# EAGLE design FW_Toolboard1_v71(Eagle 9) (EAGLE 9.7.0)
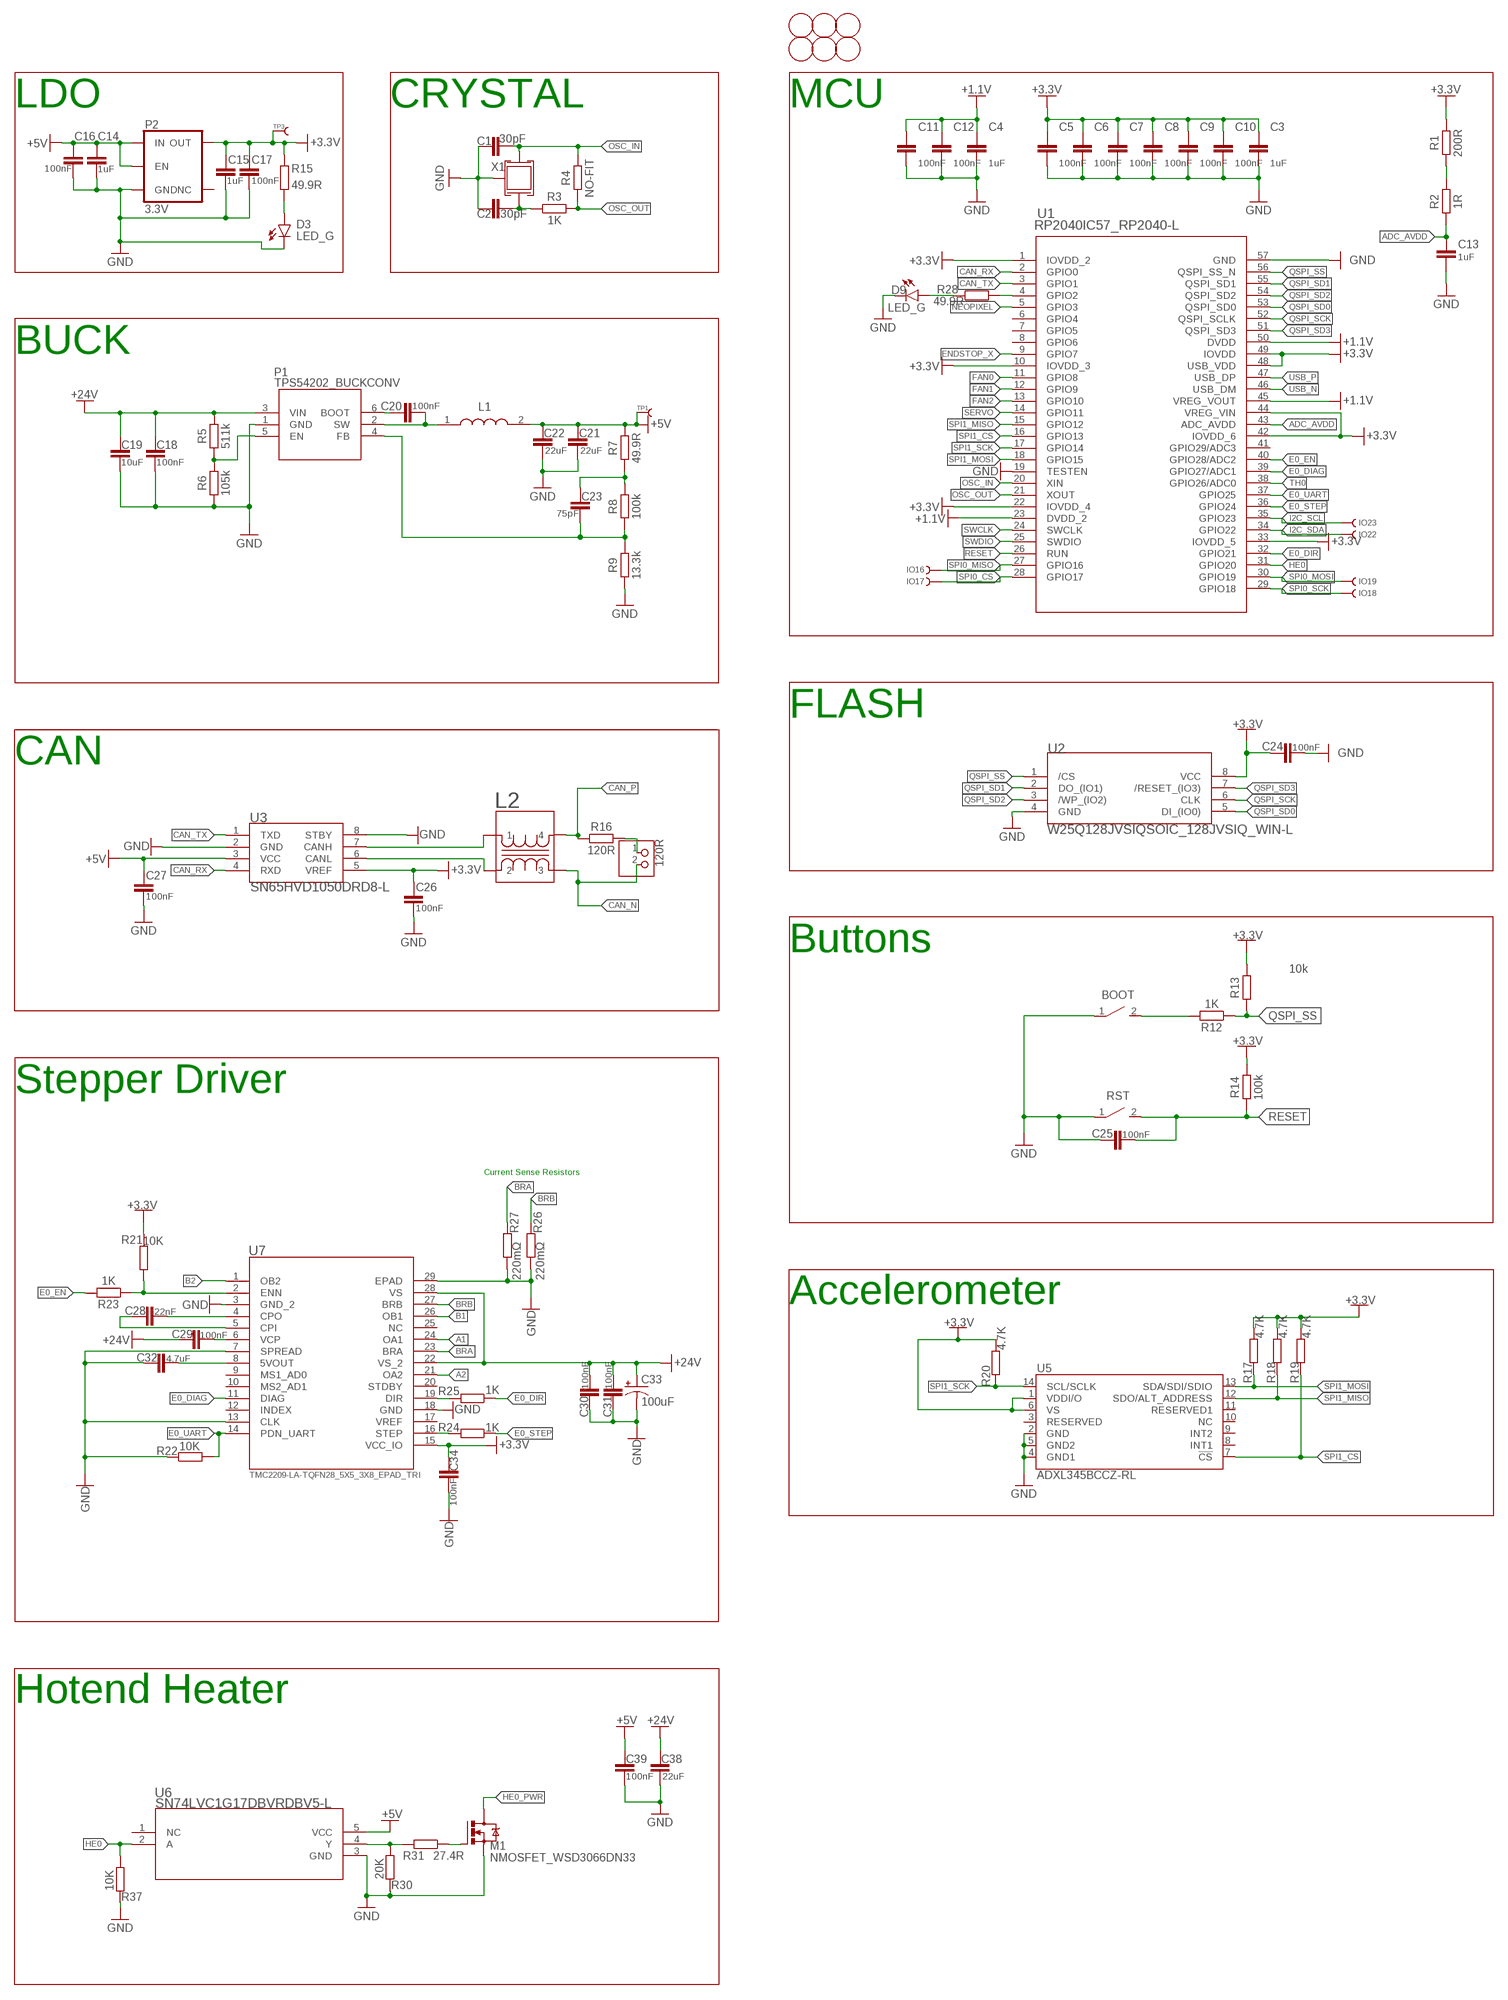
[diagram p0: schematic, sheet 1, part 1 of 2]
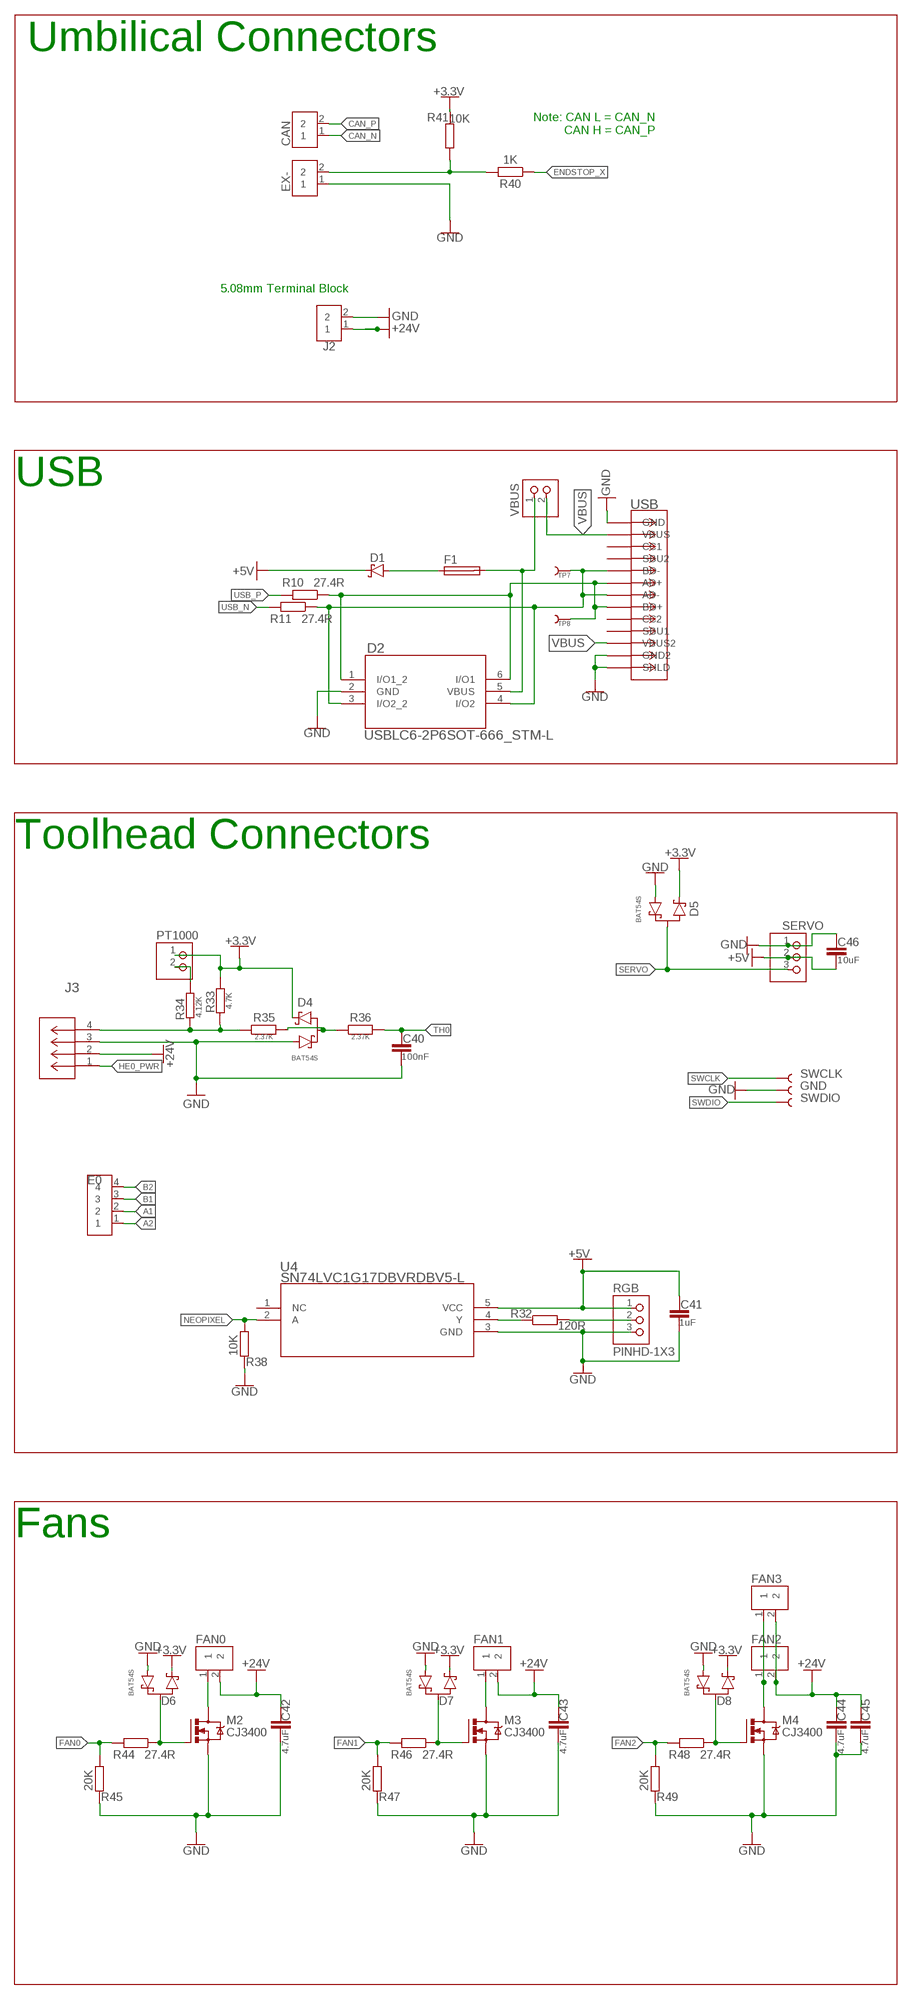
[diagram p1: schematic, sheet 1, part 2 of 2]

## Parts
120R  PINHD-1X2  [1X02]
BOOT  B3U-1000P(M)-B  B3U-X000B3U-1000P(M)-B1000P(M)-B  [B3U-1000P(M)-B]
C1  30pF  C_CHIP-0402(1005-METRIC)  [CAPC1005X60]
C2  30pF  C_CHIP-0402(1005-METRIC)  [CAPC1005X60]
C3  1uF  C_CHIP-0402(1005-METRIC)  [CAPC1005X60]
C4  1uF  C_CHIP-0402(1005-METRIC)  [CAPC1005X60]
C5  100nF  C_CHIP-0402(1005-METRIC)  [CAPC1005X60]
C6  100nF  C_CHIP-0402(1005-METRIC)  [CAPC1005X60]
C7  100nF  C_CHIP-0402(1005-METRIC)  [CAPC1005X60]
C8  100nF  C_CHIP-0402(1005-METRIC)  [CAPC1005X60]
C9  100nF  C_CHIP-0402(1005-METRIC)  [CAPC1005X60]
C10  100nF  C_CHIP-0402(1005-METRIC)  [CAPC1005X60]
C11  100nF  C_CHIP-0402(1005-METRIC)  [CAPC1005X60]
C12  100nF  C_CHIP-0402(1005-METRIC)  [CAPC1005X60]
C13  1uF  C_CHIP-0402(1005-METRIC)  [CAPC1005X60]
C14  1uF  C_CHIP-0402(1005-METRIC)  [CAPC1005X60]
C15  1uF  C_CHIP-0402(1005-METRIC)  [CAPC1005X60]
C16  100nF  C_CHIP-0402(1005-METRIC)  [CAPC1005X60]
C17  100nF  C_CHIP-0402(1005-METRIC)  [CAPC1005X60]
C18  100nF  C_CHIP-0402(1005-METRIC)  [CAPC1005X60]
C19  10uF  C_CHIP-0603(1608-METRIC)  [CAPC1608X85]
C20  100nF  C_CHIP-0402(1005-METRIC)  [CAPC1005X60]
C21  22uF  C_CHIP-0805(2012-METRIC)  [CAPC2012X110]
C22  22uF  C_CHIP-0805(2012-METRIC)  [CAPC2012X110]
C23  75pF  C_CHIP-0402(1005-METRIC)  [CAPC1005X60]
C24  100nF  C_CHIP-0402(1005-METRIC)  [CAPC1005X60]
C25  100nF  C_CHIP-0402(1005-METRIC)  [CAPC1005X60]
C26  100nF  C_CHIP-0402(1005-METRIC)  [CAPC1005X60]
C27  100nF  C_CHIP-0402(1005-METRIC)  [CAPC1005X60]
C28  22nF  C_CHIP-0402(1005-METRIC)  [CAPC1005X60]
C29  100nF  C_CHIP-0402(1005-METRIC)  [CAPC1005X60]
C30  100nF  C_CHIP-0402(1005-METRIC)  [CAPC1005X60]
C31  100nF  C_CHIP-0402(1005-METRIC)  [CAPC1005X60]
C32  4.7uF  C_CHIP-0603(1608-METRIC)  [CAPC1608X85]
C33  100uF  100UF-POLAR-25V-20%(ELEC)  [PANASONIC_D]
C34  100nF  C_CHIP-0402(1005-METRIC)  [CAPC1005X60]
C38  22uF  C_CHIP-0805(2012-METRIC)  [CAPC2012X110]
C39  100nF  C_CHIP-0402(1005-METRIC)  [CAPC1005X60]
C40  100nF  C_CHIP-0402(1005-METRIC)  [CAPC1005X60]
C41  1uF  C_CHIP-0402(1005-METRIC)  [CAPC1005X60]
C42  4.7uF  C_CHIP-0603(1608-METRIC)  [CAPC1608X85]
C43  4.7uF  C_CHIP-0603(1608-METRIC)  [CAPC1608X85]
C44  4.7uF  C_CHIP-0603(1608-METRIC)  [CAPC1608X85]
C45  4.7uF  C_CHIP-0603(1608-METRIC)  [CAPC1608X85]
C46  10uF  C_CHIP-0603(1608-METRIC)  [CAPC1608X85]
CAN  3A/250V  S2B-XH-A  [S2B-XH-A]
D1  MBR0520LT1G  SCHOTTKY_MBR0520LT1GDO-219  [SODFL3718X115]
D2  USBLC6-2P6SOT-666_STM-L  [SOT-666_STM-L]
D3  LED_G  CHIP-FLAT-G_0603-0.35MM  [LEDC1608X35N_FLAT-G]
D4  BAT54S  [SOT23]
D5  BAT54S  [SOT23]
D6  BAT54S  [SOT23]
D7  BAT54S  [SOT23]
D8  BAT54S  [SOT23]
D9  LED_G  CHIP-FLAT-G_0603-0.35MM  [LEDC1608X35N_FLAT-G]
E0  3A/250V  S4B-XH-A  [S4B-XH-A]
EX-  3A/250V  S2B-XH-A  [S2B-XH-A]
F1  FUSE_CHIP-0603(1608-METRIC)  [FUSC1608X60N]
FAN0  3A/250V  S2B-XH-A  [S2B-XH-A]
FAN1  3A/250V  S2B-XH-A  [S2B-XH-A]
FAN2  3A/250V  S2B-XH-A  [S2B-XH-A]
FAN3  3A/250V  S2B-XH-A  [S2B-XH-A]
FD1  FIDUCIAL  [FIDUCIAL_1MM]
FD2  FIDUCIAL  [FIDUCIAL_1MM]
FD3  FIDUCIAL  [FIDUCIAL_1MM]
FD4  FIDUCIAL  [FIDUCIAL_1MM]
FD5  FIDUCIAL  [FIDUCIAL_1MM]
FD6  FIDUCIAL  [FIDUCIAL_1MM]
GND  TEST-POINT3X4  [PAD.03X.04]
IO16  TEST-POINT3  [PAD.03X.03]
IO17  TEST-POINT3  [PAD.03X.03]
IO18  TEST-POINT3  [PAD.03X.03]
IO19  TEST-POINT3  [PAD.03X.03]
IO22  TEST-POINT3  [PAD.03X.03]
IO23  TEST-POINT3  [PAD.03X.03]
J2  2828XX-2282837-2  [TERMBLK_508-2N]
J3  430450400CON_430450400_MOL  [CON_430450400_MOL]
L1  ASPI-0630HI-100M-T157X7X4  [SMDRI74-680MT]
L2  ACM2012-201-2P-T002ACM2012_TDK  [ACM2012_TDK]
M1  NMOSFET_WSD3066DN33  [NMOSFET_WSD3066DN33]
M2  CJ3400  NMOSFET_BSS123_SOT23-GSD  [SOT23]
M3  CJ3400  NMOSFET_BSS123_SOT23-GSD  [SOT23]
M4  CJ3400  NMOSFET_BSS123_SOT23-GSD  [SOT23]
P1  TPS54202_BUCKCONV  [SOT-23-6]
P2  3.3V  V_REG_AP2112K-3.3V  [SOT23-5]
PT1000  PINHD-1X2  [1X02]
R1  200R  R_CHIP-0402(1005-METRIC)  [RESC1005X40]
R2  1R  R_CHIP-0402(1005-METRIC)  [RESC1005X40]
R3  1K  R_CHIP-0402(1005-METRIC)  [RESC1005X40]
R4  NO-FIT  R_CHIP-0402(1005-METRIC)  [RESC1005X40]
R5  511k  R_CHIP-0402(1005-METRIC)  [RESC1005X40]
R6  105k  R_CHIP-0402(1005-METRIC)  [RESC1005X40]
R7  49.9R  R_CHIP-0402(1005-METRIC)  [RESC1005X40]
R8  100k  R_CHIP-0402(1005-METRIC)  [RESC1005X40]
R9  13.3k  R_CHIP-0402(1005-METRIC)  [RESC1005X40]
R10  27.4R  R_CHIP-0402(1005-METRIC)  [RESC1005X40]
R11  27.4R  R_CHIP-0402(1005-METRIC)  [RESC1005X40]
R12  1K  R_CHIP-0402(1005-METRIC)  [RESC1005X40]
R13  10k  R_CHIP-0402(1005-METRIC)  [RESC1005X40]
R14  100k  R_CHIP-0402(1005-METRIC)  [RESC1005X40]
R15  49.9R  R_CHIP-0402(1005-METRIC)  [RESC1005X40]
R16  120R  R_CHIP-0402(1005-METRIC)  [RESC1005X40]
R17  4.7K  R_CHIP-0402(1005-METRIC)  [RESC1005X40]
R18  4.7K  R_CHIP-0402(1005-METRIC)  [RESC1005X40]
R19  4.7K  R_CHIP-0402(1005-METRIC)  [RESC1005X40]
R20  4.7K  R_CHIP-0402(1005-METRIC)  [RESC1005X40]
R21  10K  R_CHIP-0402(1005-METRIC)  [RESC1005X40]
R22  10K  R_CHIP-0402(1005-METRIC)  [RESC1005X40]
R23  1K  R_CHIP-0402(1005-METRIC)  [RESC1005X40]
R24  1K  R_CHIP-0402(1005-METRIC)  [RESC1005X40]
R25  1K  R_CHIP-0402(1005-METRIC)  [RESC1005X40]
R26  220mΩ  R_CHIP-0402(1005-METRIC)  [RESC1005X40]
R27  220mΩ  R_CHIP-0402(1005-METRIC)  [RESC1005X40]
R28  49.9R  R_CHIP-0402(1005-METRIC)  [RESC1005X40]
R30  20K  R_CHIP-0402(1005-METRIC)  [RESC1005X40]
R31  27.4R  R_CHIP-0402(1005-METRIC)  [RESC1005X40]
R32  120R  R_CHIP-0402(1005-METRIC)  [RESC1005X40]
R33  4.7K  R_CHIP-0402(1005-METRIC)  [RESC1005X40]
R34  4.12K  R_CHIP-0402(1005-METRIC)  [RESC1005X40]
R35  2.37K  R_CHIP-0402(1005-METRIC)  [RESC1005X40]
R36  2.37K  R_CHIP-0402(1005-METRIC)  [RESC1005X40]
R37  10K  R_CHIP-0402(1005-METRIC)  [RESC1005X40]
R38  10K  R_CHIP-0402(1005-METRIC)  [RESC1005X40]
R40  1K  R_CHIP-0402(1005-METRIC)  [RESC1005X40]
R41  10K  R_CHIP-0402(1005-METRIC)  [RESC1005X40]
R44  27.4R  R_CHIP-0402(1005-METRIC)  [RESC1005X40]
R45  20K  R_CHIP-0402(1005-METRIC)  [RESC1005X40]
R46  27.4R  R_CHIP-0402(1005-METRIC)  [RESC1005X40]
R47  20K  R_CHIP-0402(1005-METRIC)  [RESC1005X40]
R48  27.4R  R_CHIP-0402(1005-METRIC)  [RESC1005X40]
R49  20K  R_CHIP-0402(1005-METRIC)  [RESC1005X40]
RGB  PINHD-1X3  [1X03]
RST  B3U-1000P(M)-B  B3U-X000B3U-1000P(M)-B1000P(M)-B  [B3U-1000P(M)-B]
SERVO  PINHD-1X3  [1X03]
SWCLK  TEST-POINT3X4  [PAD.03X.04]
SWDIO  TEST-POINT3X4  [PAD.03X.04]
TP1  TEST-POINT3  [PAD.012X.012]
TP3  TEST-POINT3  [PAD.012X.012]
TP7  TEST-POINT3  [PAD.012X.012]
TP8  TEST-POINT3  [PAD.012X.012]
U1  RP2040IC57_RP2040-L  [IC57_RP2040-L]
U2  W25Q128JVSIQSOIC_128JVSIQ_WIN-L  [SOIC_128JVSIQ_WIN-L]
U3  SN65HVD1050DRD8-L  [D8-L]
U4  SN74LVC1G17DBVRDBV5-L  [DBV5-L]
U5  ADXL345BCCZ-RL  [ADXL345_LGA14]
U6  SN74LVC1G17DBVRDBV5-L  [DBV5-L]
U7  TMC2209-LA-TQFN28_5X5_3X8_EPAD_TRI  [QFN28_5X5_3X8_EPAD_TRI]
USB  USB-C(KH-TYPE-C-16P)  [CONN12_KH-TYPE-C-16P]
VBUS  PINHD-1X2  [1X02]
X1  CRYSTAL_TAXM12M4RLBDDT2T_3225  [CRYSTAL_3225]

## Nets
+1.1V [POWER]: C4.1 C11.1 C12.1 U1.23(DVDD_2) U1.45(VREG_VOUT) U1.50(DVDD)
+3.3V [POWER]: C3.1 C5.1 C6.1 C7.1 C8.1 C9.1 C10.1 C15.1 C17.1 C24.1 C26.1 C34.1 D4.2 D5.2 D6.2 D7.2 D8.2 P2.5(OUT) PT1000.1 R1.2 R13.2 R14.2 R15.2 R17.2 R18.2 R19.2 R20.2 R21.1 R33.2 R41.1 TP3.P$1 U1.1(IOVDD_2) U1.10(IOVDD_3) U1.22(IOVDD_4) U1.33(IOVDD_5) U1.42(IOVDD_6) U1.44(VREG_VIN) U1.48(USB_VDD) U1.49(IOVDD) U2.8(VCC) U3.5(VREF) U5.1(VDDI/O) U5.6(VS) U7.15(VCC_IO)
+5V [POWER]: C14.1 C16.1 C21.1 C22.1 C27.1 C39.1 C41.1 C46.2 D1.1(C) L1.2 P2.1(IN) P2.3(EN) R7.2 RGB.1 SERVO.2 TP1.P$1 U3.3(VCC) U4.5(VCC) U6.5(VCC)
+24V [POWER]: C18.1 C19.1 C29.1 C30.2 C31.2 C33.+ C38.1 C42.1 C43.1 C44.1 C45.1 FAN0.2 FAN1.2 FAN2.2 FAN3.2 J2.1 J3.2 P1.3(VIN) R5.2 U7.22(VS_2) U7.28(VS)
A1 [POWER]: E0.2 U7.24(OA1)
A2 [POWER]: E0.1 U7.21(OA2)
ADC_AVDD: C13.1 R2.1 U1.43(ADC_AVDD)
ADC_R: R1.1 R2.2
B1 [POWER]: E0.3 U7.26(OB1)
B2 [POWER]: E0.4 U7.1(OB2)
BCBOOT: C20.1 P1.6(BOOT)
BRA: R27.2 U7.23(BRA)
BRB: R26.2 U7.27(BRB)
CAN1_N [DIFF]: L2.2 U3.6(CANL)
CAN1_P [DIFF]: L2.1 U3.7(CANH)
CAN_N [DIFF]: 120R.2 CAN.1 L2.3
CAN_P [DIFF]: CAN.2 L2.4 R16.1
CAN_RX: U1.2(GPIO0) U3.4(RXD)
CAN_TX: U1.3(GPIO1) U3.1(TXD)
CNT: 120R.1 R16.2
DIR: R25.2 U7.19(DIR)
E0_DIAG: U1.39(GPIO27/ADC1) U7.11(DIAG)
E0_DIR: R25.1 U1.32(GPIO21)
E0_EN: R23.2 U1.40(GPIO28/ADC2)
E0_STEP: R24.1 U1.36(GPIO24)
E0_UART: R22.2 U1.37(GPIO25) U7.14(PDN_UART)
ENDSTOP_X: R40.1 U1.9(GPIO7)
EX: EX-.2 R40.2 R41.2
FAN0: R44.2 R45.2 U1.11(GPIO8)
FAN0D: FAN0.1 M2.3(D)
FAN0G: D6.3 M2.1(G) R44.1
FAN1: R46.2 R47.2 U1.12(GPIO9)
FAN1D: FAN1.1 M3.3(D)
FAN1G: D7.3 M3.1(G) R46.1
FAN2: R48.2 R49.2 U1.13(GPIO10)
FAN2D: FAN2.1 FAN3.1 M4.3(D)
FAN2G: D8.3 M4.1(G) R48.1
GND [POWER]: BOOT.1 C1.2 C2.1 C3.2 C4.2 C5.2 C6.2 C7.2 C8.2 C9.2 C10.2 C11.2 C12.2 C13.2 C14.2 C15.2 C16.2 C17.2 C18.2 C19.2 C21.2 C22.2 C24.2 C25.1 C26.2 C27.2 C30.1 C31.1 C32.1 C33.- C34.2 C38.2 C39.2 C40.2 C41.2 C42.2 C43.2 C44.2 C45.2 C46.1 D2.2(GND) D3.C D4.1 D5.1 D6.1 D7.1 D8.1 D9.C EX-.1 GND.P$1 J2.2 J3.3 M1.P$1(S) M1.P$2(S) M1.P$3(S) M2.2(S) M3.2(S) M4.2(S) P1.1(GND) P2.2(GND) R6.1 R9.1 R22.1 R26.1 R27.1 R30.1 R37.1 R38.1 R45.1 R47.1 R49.1 RGB.3 RST.1 SERVO.1 U1.19(TESTEN) U1.57(GND) U2.4(GND) U3.2(GND) U3.8(STBY) U4.3(GND) U5.2(GND) U5.4(GND1) U5.5(GND2) U6.3(GND) U7.3(GND_2) U7.7(SPREAD) U7.13(CLK) U7.18(GND) U7.29(EPAD) USB.1(GND) USB.12(GND2) USB.13(SHLD) USB.14(SHLD) USB.15(SHLD) USB.16(SHLD) USB.18(SHLD) USB.19(SHLD) USB.20(SHLD) USB.21(SHLD) USB.24(SHLD) USB.25(SHLD) USB.26(SHLD) USB.27(SHLD) USB.28(SHLD) USB.29(SHLD) USB.37(SHLD) USB.39(SHLD) USB.41(SHLD) USB.43(SHLD) X1.P$2(GND) X1.P$4(GND)
GPIOLED: D9.A R28.1
HE0: R37.2 U1.31(GPIO20) U6.2(A)
HE0_PWR [POWER]: J3.1 M1.P$5(D) M1.P$6(D) M1.P$7(D) M1.P$8(D) M1.P$9(D)
HE0A: R30.2 R31.2 U6.4(Y)
HE0B: M1.P$4(G) R31.1
I2C_SCL: IO23.P$1 U1.35(GPIO23)
I2C_SDA: IO22.P$1 U1.34(GPIO22)
LDOLED: D3.A R15.1
LED: R28.2 U1.4(GPIO2)
NEOPIXEL: R38.2 U1.5(GPIO3) U4.2(A)
OSC_IN: C1.1 R4.2 U1.20(XIN) X1.P$1(P1)
OSC_OUT: R3.2 R4.1 U1.21(XOUT)
QSPI_SCK: U1.52(QSPI_SCLK) U2.6(CLK)
QSPI_SD0: U1.53(QSPI_SD0) U2.5(DI_(IO0))
QSPI_SD1: U1.55(QSPI_SD1) U2.2(DO_(IO1))
QSPI_SD2: U1.54(QSPI_SD2) U2.3(/WP_(IO2))
QSPI_SD3: U1.51(QSPI_SD3) U2.7(/RESET_(IO3))
QSPI_SS: R12.1 R13.1 U1.56(QSPI_SS_N) U2.1(/CS)
RESET: C25.2 R14.1 RST.2 U1.26(RUN)
RGBDATA: R32.2 RGB.2
RGBDATA1: R32.1 U4.4(Y)
SERVO: D5.3 SERVO.3 U1.14(GPIO11)
SPI0_CS: IO17.P$1 U1.28(GPIO17)
SPI0_MISO: IO16.P$1 U1.27(GPIO16)
SPI0_MOSI: IO19.P$1 U1.30(GPIO19)
SPI0_SCK: IO18.P$1 U1.29(GPIO18)
SPI1_CS: R19.1 U1.16(GPIO13) U5.7(!CS)
SPI1_MISO: R18.1 U1.15(GPIO12) U5.12(SDO/ALT_ADDRESS)
SPI1_MOSI: R17.1 U1.18(GPIO15) U5.13(SDA/SDI/SDIO)
SPI1_SCK: R20.1 U1.17(GPIO14) U5.14(SCL/SCLK)
STEP: R24.2 U7.16(STEP)
SWB: BOOT.2 R12.2
SWCLK: SWCLK.P$1 U1.24(SWCLK)
SWDIO: SWDIO.P$1 U1.25(SWDIO)
TH0: C40.1 R36.2 U1.38(GPIO26/ADC0)
TH0A: J3.4 R33.1 R34.1 R35.1
TH0B: D4.3 R35.2 R36.1
TH0C: PT1000.2 R34.2
TMC5V: C32.2 U7.8(5VOUT)
TMCCPI: C28.1 U7.5(CPI)
TMCCPO: C28.2 U7.4(CPO)
TMCENN: R21.2 R23.1 U7.2(ENN)
TMCVCP: C29.2 U7.6(VCP)
USB1_N [DIFF]: D2.3(I/O2_2) D2.4(I/O2) R11.1 TP7.P$1 USB.5(BD-) USB.7(AD-)
USB1_P [DIFF]: D2.1(I/O1_2) D2.6(I/O1) R10.1 TP8.P$1 USB.6(AD+) USB.8(BD+)
USB_N [DIFF]: R11.2 U1.46(USB_DM)
USB_P [DIFF]: R10.2 U1.47(USB_DP)
VBUS [POWER]: USB.2(VBUS) USB.11(VBUS2) VBUS.2
VBUS1 [POWER]: D2.5(VBUS) F1.2 VBUS.1
VBUS2 [POWER]: D1.2(A) F1.1
VRC: C23.1 R7.1 R8.2
VREGEN: P1.5(EN) R5.1 R6.2
VREGFB: C23.2 P1.4(FB) R8.1 R9.2
VREGO: C20.2 L1.1 P1.2(SW)
XR: C2.2 R3.1 X1.P$3(P2)
Unconnected: P2.4(NC) U1.6(GPIO4) U1.7(GPIO5) U1.8(GPIO6) U1.41(GPIO29/ADC3) U4.1(NC) U5.3(RESERVED) U5.8(INT1) U5.9(INT2) U5.10(NC) U5.11(RESERVED1) U6.1(NC) U7.9(MS1_AD0) U7.10(MS2_AD1) U7.12(INDEX) U7.17(VREF) U7.20(STDBY) U7.25(NC) USB.3(CC1) USB.4(SBU2) USB.9(CC2) USB.10(SBU1)

## Notes on the sheet
- LDO | CRYSTAL | MCU | Umbilical Connectors
- Note: CAN L = CAN_N
  CAN H = CAN_P
- 5.08mm Terminal Block
- BUCK
- USB
- FLASH
- CAN
- Toolhead Connectors
- Buttons
- Stepper Driver
- Current Sense Resistors
- Accelerometer
- Fans
- Hotend Heater

## Library data of the parts
120R PT1000 VBUS = Fracktal Misc Lib:PINHD-1X2: PIN HEADER; CATEGORY: CONNECTOR; SUB-CATEGORY: PIN-HEADER
BOOT RST = Switch:B3U-X000: Ultra-small Tactile Switch Contact form : SPST-NO Datasheet <https://omronfs.omron.com/en_US/ecb/products/pdf/en-b3u.pdf>; CATEGORY: SWITCH; DESCRIPTION: Ultra-small Surface-mounting Tactile Switches with High Contact Reliability; LCSCPN#: C231329; MANUFACTURER: OMRON; OPERATING_TEMPERATURE: -25°C to +70°C at 60%RH max; PART_STATUS: ACTIVE; SERIES: B3U; TYPE: Tactile
C1 C2 = Fracktal Misc Lib:C: Capacitor - Generic; CATEGORY: Capacitor; LCSCPN#: C1570
C3 C4 C13-C15 C41 = Fracktal Misc Lib:C: Capacitor - Generic; CATEGORY: Capacitor; LCSCPN#: C52923
C5-C12 C16-C18 C20 C24-C27 C29-C31 C34 C39 C40 = Fracktal Misc Lib:C: Capacitor - Generic; CATEGORY: Capacitor; LCSCPN#: C307331
C19 C46 = Fracktal Misc Lib:C: Capacitor - Generic; CATEGORY: Capacitor; LCSCPN#: C194427
C21 C22 C38 = Fracktal Misc Lib:C: Capacitor - Generic; CATEGORY: Capacitor; LCSCPN#: C338080
C23 = Fracktal Misc Lib:C: Capacitor - Generic; CATEGORY: Capacitor; LCSCPN#: C37809
C28 = Fracktal Misc Lib:C: Capacitor - Generic; CATEGORY: Capacitor; LCSCPN#: C1532
C32 C42-C45 = Fracktal Misc Lib:C: Capacitor - Generic; CATEGORY: Capacitor; LCSCPN#: C162274
C33 = Fracktal Misc Lib:100UF-POLAR: 100µF polarized capacitors A capacitor is a passive two-terminal electrical component used to store electrical energy temporarily in an electric field.; LCSCPN#: C128464; PROD_ID: CAP-12547
CAN EX- FAN0 FAN1-FAN3 = Connector:S2B-XH-A: CONN HEADER R/A 2POS 2.5MM Manufacturer's datasheet <http://www.jst-mfg.com/product/pdf/eng/eXH.pdf>; CREATED_BY: PCBLayout.com; DIGIKEY_PART_NUMBER: 455-2257-ND; MANUFACTURER: JST Sales America Inc.; MPN: S2B-XH-A(LF)(SN)
D1 = Diode:SCHOTTKY_: Schottky Diode - Popular parts; CATEGORY: Diode; DESCRIPTION: DIODE SCHOTTKY 20V 500MA SOD123; MANUFACTURER: ON Semiconductor; MPN: MBR0520LT1G; SUB-CATEGORY: Schottky
D2 = 2023-04-02_04-17-07_Library:USBLC6-2P6; COPYRIGHT: Copyright (C) 2023 Ultra Librarian. All rights reserved.; LCSCPN#: C2827693; MANUFACTURER_PART_NUMBER: USBLC6-2P6; MFR_NAME: STMicroelectronics
D3 D9 = LED:CHIP-FLAT-G; CATEGORY: LED; COLOR: GREEN; DESCRIPTION: CHIP LED FLAT; LCSCPN#: C72043; SUB-CATEGORY: CHIP; TYPE: FLAT_TOP; VALUE: LED_GREEN
D4-D8 = Fracktal Misc Lib:BAT54S; LCSCPN#: C47546
E0 = Fracktal Misc Lib:S4B-XH-A; CATEGORY: Header; DESCRIPTION: Connector Header Through Hole, Right Angle 4 position 0.098" (2.50mm); MANUFACTURER: JST Sales America Inc.; MPN: S4B-XH-A(LF)(SN); OPERATING_TEMPERATURE: -25°C ~ 85°C; PART_STATUS: Active; PITCH: 0.098" (2.50mm); ROHS_COMPLIANCE: ROHS3 Compliant; SERIES: XH; SUBCATEGORY: Rectangular Connectors; TYPE: Header, Male Pin, Board to Cable/Wire, Through Hole
F1 = Circuit-Protection:FUSE: Fuse - Generic; CATEGORY: Circuit-Protection; LCSCPN#: C261937; SUB-CATEGORY: Fuse
FD1-FD6 = CDC Library:FIDUCIAL: For use by pick and place machines to calibrate the vision/machine, 1mm By microbuilder.eu
GND IO16-IO19 IO22 IO23 SWCLK SWDIO = SparkFun-Connectors:TEST-POINT: SparkFun Test Points Bare copper test points for troubleshooting or In-Circuit-Testing. These are used by our Production team for verifying production board runs using pogo-pins on test beds. SparkFun Products: SparkFun LSM9DS1 Breakout <https://www.sparkfun.com/products/13284> SparkFun PSOC <https://www.sparkfun.com/products/13714> SparkFun Load Cell Amplifier <https://www.sparkfun.com/products/13879>
J2 = Connector:2828XX-2: 2 Position Wire to Board Terminal Block Horizontal with Board Datasheet <https://www.te.com.cn/commerce/DocumentDelivery/DDEController?Action=showdoc&DocId=Catalog+Section%7F1308389_EUROSTYLE_TERMINAL_BLOCKS%7F0607%7Fpdf%7FEnglish%7FENG_CS_1308389_EUROSTYLE_TERMINAL_BLOCKS_0607.pdf%7F2-282837-5>; CATEGORY: Connector; DESCRIPTION: 2 Position Wire to Board Terminal Block Horizontal with Board 5.08 mm Through Hole; MANUFACTURER: TE Connectivity; MPN: 282837-2; OPERATING_TEMPERATURE: -40°C to +105°C; PART_STATUS: ACTIVE; ROHS_COMPLIANCE: RoHS Compliant; SERIES: 282837; SUBCATEGORY: Terminal Block; TYPE: Side Wire Entry
J3 = Fracktal Misc Lib:430450400; COPYRIGHT: Copyright (C) 2023 Ultra Librarian. All rights reserved.; MANUFACTURER_PART_NUMBER: 430450400; MFR_NAME: Molex Connector Corporation
L1 = Fracktal Misc Lib:ASPI-0630HI-100M-T15: Inductor Power Molded Wirewound 10uH 20% 3A 105mOhm DCR T/R Source: Datasheet <https://www.arrow.com/en/products/aspi-0630hi-100m-t15/abracon>; LCSCPN#: C3000391
L2 = 2023-04-02_14-21-16_Library:ACM2012-201-2P-T002; COPYRIGHT: Copyright (C) 2023 Ultra Librarian. All rights reserved.; LCSCPN#: C3029258; MANUFACTURER_PART_NUMBER: ACM2012-201-2P-T002; MFR_NAME: TDK
M1 = Fracktal Misc Lib:NMOSFET_WSD3066DN33; LCSCPN#: C148386
M2-M4 = Transistor:NMOSFET_: N-Channel MOSFET - Popular parts; CATEGORY: Transistor; DESCRIPTION: MOSFET N-CH 100V 0.17A SOT-23; DRAIN_CURRENT: 170mA; LCSCPN#: C19019; MANUFACTURER: ON Semiconductor; MPN: BSS123L; OPERATING_TEMP: -55°C ~ 150°C; PART_STATUS: Active; ROHS_COMPLIANT: Yes; SUB-CATEGORY: MOSFET; THERMALLOSS: 360mW; TYPE: N-Channel; VALUE: BSS123
P1 = Fracktal Misc Lib:TPS54202_BUCKCONV; LCSCPN#: C191884
P2 = SparkFun-IC-Power:V_REG_AP2112: AP2112 - 600mA CMOS LDO Regulator w/ Enable The AP2112 is CMOS process low dropout linear regulator with enable function, the regulator delivers a guaranteed 600mA (min.) continuous load current. Features Output Voltage Accuracy: ±1.5% Output Current: 600mA (Min.) Foldback Short Current Protection: 50mA Enable Function to Turn ON/OFF VOUT Low Dropout Voltage (3.3V): 250mV (Typ.) @IOUT=600mA Excellent Load Regulation: 0.2%/A (Typ.) Excellent Line Regulation: 0.02%/V (Typ.) Low Quiescent Current: 55μA (Typ.) Low Standby Current: 0.01μA (Typ.) Low Output Noise: 50μVRMS PSRR: 100Hz -65dB, 1kHz -65dB OTSD Protection Stable with 1.0μF Flexible Cap: Ceramic, Tantalum and Aluminum Electrolytic Operation Temperature Range: -40°C to 85°C ESD: MM 400V, HBM 4000V; LCSCPN#: C51118; PROD_ID: VREG-12457
R1 = Fracktal Misc Lib:R: Resistor Fixed - Generic; CATEGORY: Resistor; LCSCPN#: C25087; SUB-CATEGORY: Fixed
R2 = Fracktal Misc Lib:R: Resistor Fixed - Generic; CATEGORY: Resistor; LCSCPN#: C25086; SUB-CATEGORY: Fixed
R3 R12 R23-R25 R40 = Fracktal Misc Lib:R: Resistor Fixed - Generic; CATEGORY: Resistor; LCSCPN#: C25543; SUB-CATEGORY: Fixed
R4 R13 = Fracktal Misc Lib:R: Resistor Fixed - Generic; CATEGORY: Resistor; LCSCPN#: NO-FIT; SUB-CATEGORY: Fixed
R5 = Fracktal Misc Lib:R: Resistor Fixed - Generic; CATEGORY: Resistor; LCSCPN#: C3037035; SUB-CATEGORY: Fixed
R6 = Fracktal Misc Lib:R: Resistor Fixed - Generic; CATEGORY: Resistor; LCSCPN#: C2933067; SUB-CATEGORY: Fixed
R7 R15 R28 = Fracktal Misc Lib:R: Resistor Fixed - Generic; CATEGORY: Resistor; LCSCPN#: C25120; SUB-CATEGORY: Fixed
R8 R14 = Fracktal Misc Lib:R: Resistor Fixed - Generic; CATEGORY: Resistor; LCSCPN#: C25741; SUB-CATEGORY: Fixed
R9 = Fracktal Misc Lib:R: Resistor Fixed - Generic; CATEGORY: Resistor; LCSCPN#: C2974007; SUB-CATEGORY: Fixed
R10 R11 R31 R44 R46 R48 = Fracktal Misc Lib:R: Resistor Fixed - Generic; CATEGORY: Resistor; LCSCPN#: C31439; SUB-CATEGORY: Fixed
R16 R32 = Fracktal Misc Lib:R: Resistor Fixed - Generic; CATEGORY: Resistor; LCSCPN#: C25079; SUB-CATEGORY: Fixed
R17-R20 R33 = Fracktal Misc Lib:R: Resistor Fixed - Generic; CATEGORY: Resistor; LCSCPN#: C304616; SUB-CATEGORY: Fixed
R21 R22 R37 R38 R41 = Fracktal Misc Lib:R: Resistor Fixed - Generic; CATEGORY: Resistor; LCSCPN#: C25744; SUB-CATEGORY: Fixed
R26 R27 = Fracktal Misc Lib:R: Resistor Fixed - Generic; CATEGORY: Resistor; LCSCPN#: C705474; SUB-CATEGORY: Fixed
R30 R45 R47 R49 = Fracktal Misc Lib:R: Resistor Fixed - Generic; CATEGORY: Resistor; LCSCPN#: C25765; SUB-CATEGORY: Fixed
R34 = Fracktal Misc Lib:R: Resistor Fixed - Generic; CATEGORY: Resistor; LCSCPN#: C227106; SUB-CATEGORY: Fixed
R35 R36 = Fracktal Misc Lib:R: Resistor Fixed - Generic; CATEGORY: Resistor; LCSCPN#: C425373; SUB-CATEGORY: Fixed
RGB SERVO = Fracktal Misc Lib:PINHD-1X3: PIN HEADER; CATEGORY: CONNECTOR; SUB-CATEGORY: PIN-HEADER
TP1 TP3 TP7 TP8 = Fracktal Misc Lib:TEST-POINT: SparkFun Test Points Bare copper test points for troubleshooting or In-Circuit-Testing. These are used by our Production team for verifying production board runs using pogo-pins on test beds. SparkFun Products: SparkFun LSM9DS1 Breakout <https://www.sparkfun.com/products/13284> SparkFun PSOC <https://www.sparkfun.com/products/13714> SparkFun Load Cell Amplifier <https://www.sparkfun.com/products/13879>
U1 = 2023-03-26_17-59-48_Library:RP2040; COPYRIGHT: Copyright (C) 2023 Ultra Librarian. All rights reserved.; LCSCPN#: C2040; MANUFACTURER_PART_NUMBER: RP2040; MFR_NAME: Raspberry Pi
U2 = Fracktal Misc Lib:W25Q128JVSIQ; COPYRIGHT: Copyright (C) 2023 Ultra Librarian. All rights reserved.; LCSCPN#: C97521; MANUFACTURER_PART_NUMBER: W25Q128JVSIQ; MFR_NAME: Winbond
U3 = Fracktal Misc Lib:SN65HVD1050DR; COPYRIGHT: Copyright (C) 2023 Ultra Librarian. All rights reserved.; LCSCPN#: C14019; MANUFACTURER_PART_NUMBER: SN65HVD1050DR; MFR_NAME: Texas Instruments
U4 U6 = 2023-03-28_15-41-49_Library:SN74LVC1G17DBVR; COPYRIGHT: Copyright (C) 2023 Ultra Librarian. All rights reserved.; LCSCPN#: C7836; MANUFACTURER_PART_NUMBER: SN74LVC1G17DBVR; MFR_NAME: Texas Instruments
U5 = Sensor:ADXL345: Digital Accelerometer Datasheet <https://www.analog.com/media/en/technical-documentation/data-sheets/ADXL345.pdf>; CATEGORY: SENSOR; DESCRIPTION: Digital Accelerometer; LCSCPN#: C9667; MANUFACTURER: ANALOG DEVICES; MPN: ADXL345BCCZ-RL; OPERATING_TEMPERATURE: −55°C to +105°C; PART_STATUS: ACTIVE; ROHS_COMPLIANT: RoHS Compliant; SERIES: ADXL345; SUB-CATEGORY: Accelerometer; TYPE: 3-Axis Digital MEMS Accelerometer
U7 = Fracktal Misc Lib:TMC2209-LA-T; COPYRIGHT: Copyright (C) 2023 Ultra Librarian. All rights reserved.; DIGI-KEY_PART_NUMBER_1: 1460-1398-2-ND; DIGI-KEY_PART_NUMBER_2: 1460-1398-1-ND; DIGI-KEY_PART_NUMBER_3: 1460-1398-6-ND; DIGI-KEY_PART_NUMBER_4: 1460-TMC2209-LA-TTR-NDL; LCSCPN#: C2150710; MANUFACTURER_PART_NUMBER: TMC2209-LA-T; MFR_NAME: Trinamic
USB = Fracktal Misc Lib:USB-C(KH-TYPE-C-16P): Shenzhen Kinghelm Elec KH-TYPE-C-16P LCSCPN# C709357; DATASHEET: https://datasheet.lcsc.com/lcsc/2009111434_Shenzhen-Kinghelm-Elec-KH-TYPE-C-16P_C709357.pdf; LCSCPN#: C709357; VENDOR: LCSC
X1 = Fracktal Misc Lib:CRYSTAL_TAXM12M4RLBDDT2T_3225; LCSCPN#: C133334

## Board
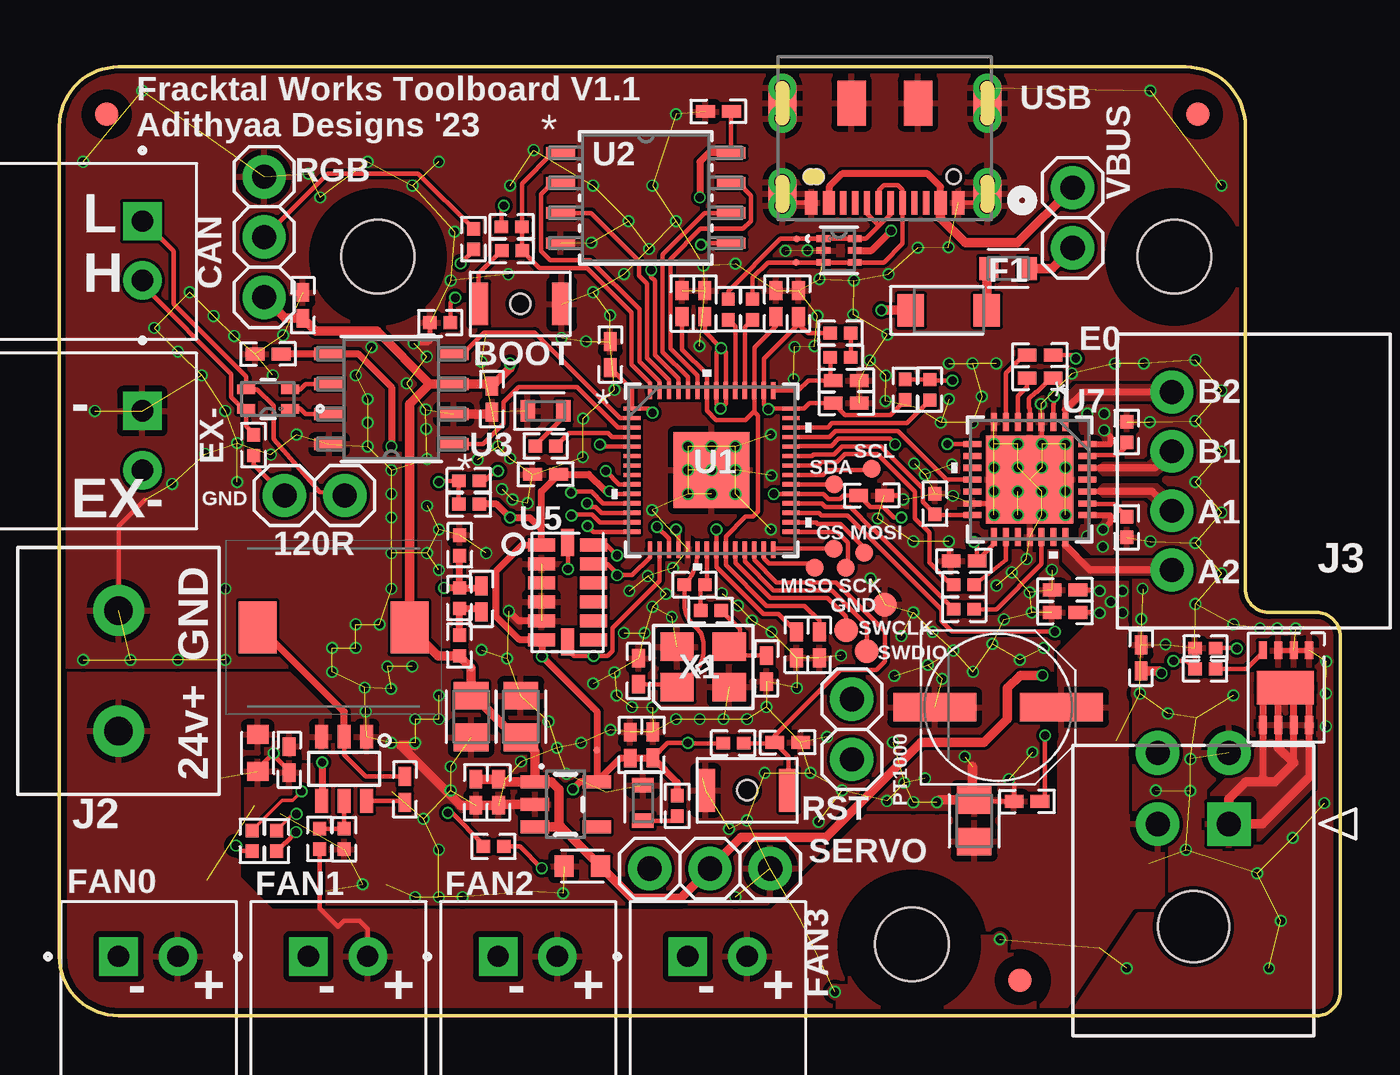
[diagram p2: board, top side]
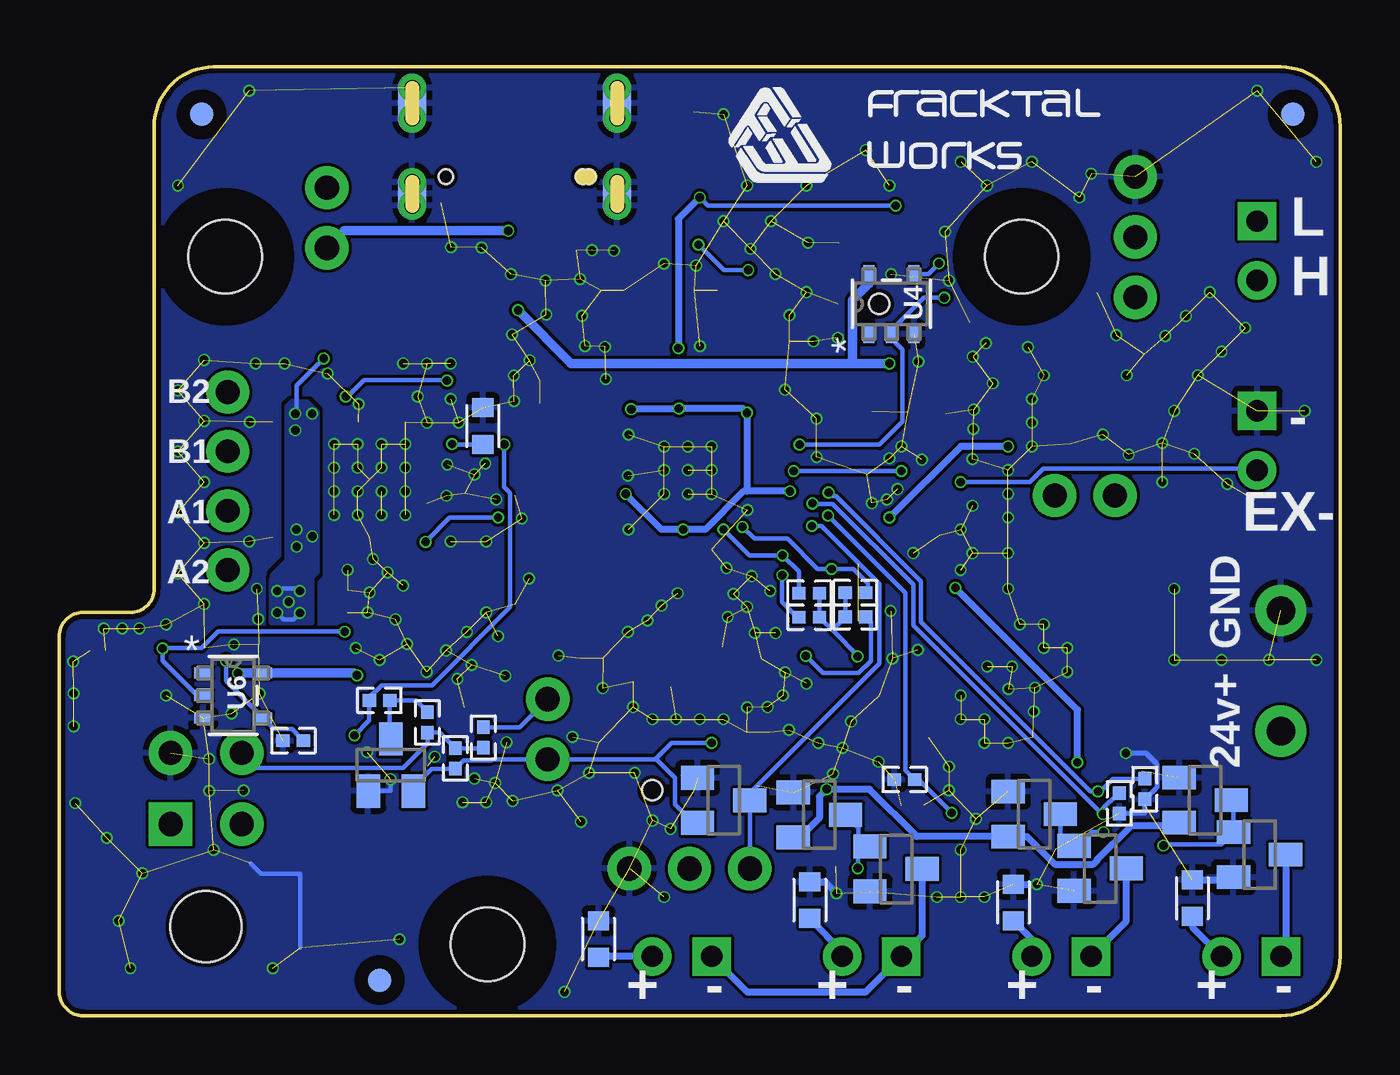
[diagram p3: board, bottom side, seen from below]

Size 54 x 40 mm. Coordinates in mm from the lower left corner, seen from the top.
Outline: 0,37.5 arc-90 2.5,40 47.5,40 arc-90 50,37.5 50,18 arc90 51,17 53,17 arc-90 54,16 54,1 arc-90 53,0 2.5,0 arc-90 0,2.5 0,37.5
Copper layers (1*16): Top 0.035mm / dielectric 1.6mm / Bottom 0.035mm
Design rules "jlcpcb-2layers": minimum track width 5mil, minimum drill 0.3mm, track to track 5mil, track to pad 5mil, pad to pad 5mil, via to via 5mil, smd to smd 5mil, copper to edge 0.2mm, drill to drill 6mil, minimum pad ring 10mil, minimum via ring 3mil, stop-mask expansion 4mil, vias tented up to drill 0mil, thermal gap 10mil
Holes 3.1 mm at 13.43,32 47,32 35.95,3
tRestrict: area 34.6,1.6 to 37.4,4.4; area 45.6,30.6 to 48.4,33.4; area 12,30.6 to 14.8,33.4
bRestrict: area 34.6,1.6 to 37.4,4.4; area 45.6,30.6 to 48.4,33.4; area 12,30.6 to 14.8,33.4

### Footprints (pad centres in the part's own frame; a part is rotated, then mirrored left to right if it is on the bottom)
1X02 = drill 1.016: 1 -1.27,0; 2 1.27,0
B3U-1000P(M)-B = smd 0.8 x 1.8: 1 -1.75,0; 2 1.75,0 | hole 0.85: 0,0
CAPC1005X60 = smd 0.79 x 0.54: 1 -0.55,0; 2 0.545,0
CAPC1608X85 = smd 0.8 x 0.9: 1 -0.775,0; 2 0.775,0
CAPC2012X110 = smd 1.165 x 1.465: 1 -0.875,0; 2 0.875,0
PANASONIC_D = smd 3.5 x 1.2: + 2.67,0; - -2.67,0
S2B-XH-A = drill 0.9 square: 1 0,0 | drill 0.9: 2 2.5,0
SODFL3718X115 = smd 1.115 x 1.361: 1 -1.6,0; 2 1.6,0
SOT-666_STM-L = smd 0.583 x 0.28: 1 -0.66,0.5; 2 -0.66,0; 3 -0.66,-0.5; 4 0.66,-0.5; 5 0.66,0; 6 0.66,0.5
LEDC1608X35N_FLAT-G = smd 0.612 x 0.912: A 0.75,0; C -0.75,0
SOT23 = smd 1 x 1.4: 1 -0.95,-1.1; 2 0.95,-1.1; 3 0,1.1
S4B-XH-A = drill 1: 1 0,0; 2 2.5,0; 3 5,0; 4 7.5,0
FUSC1608X60N = smd 0.799 x 0.974: 1 -0.815,0; 2 0.815,0
FIDUCIAL_1MM = smd 1 x 1: 1 0,0
PAD.03X.04 = smd 1.016 x 1.016: P$1 0,0
PAD.03X.03 = smd 0.762 x 0.762: P$1 0,0
TERMBLK_508-2N = drill 1.2: 1 0,0; 2 5.08,0
CON_430450400_MOL = drill 1.02 pad 1.52 square: 1 0,0 | drill 1.02 pad 1.52: 2 -3,0; 3 0,3; 4 -3,3 | hole 3: -1.5,-4.32
SMDRI74-680MT = smd 1.6 x 2.2: 1 -3.2,0; 2 3.2,0
ACM2012_TDK = smd 0.762 x 0.406: 1 -0.925,0.406; 2 -0.925,-0.406; 3 0.925,-0.406; 4 0.925,0.406
NMOSFET_WSD3066DN33 = smd 0.75 x 0.35: P$1 -1.575,1; P$2 -1.575,0.35; P$3 -1.575,-0.3; P$4 -1.575,-0.95; P$5 1.575,-0.95; P$6 1.575,-0.3; P$7 1.575,0.35; P$8 1.575,1 | smd 1.4 x 2.4: P$9 0,0
SOT-23-6 = smd 1 x 0.55: 1 -1.35,0.95; 2 -1.35,0; 3 -1.35,-0.95; 4 1.35,-0.95; 5 1.35,0; 6 1.35,0.95
SOT23-5 = smd 0.55 x 1.2: 1 -0.95,-1.3; 2 0,-1.3; 3 0.95,-1.3; 4 0.95,1.3; 5 -0.95,1.3
RESC1005X40 = smd 0.566 x 0.54: 1 -0.433,0; 2 0.433,0
1X03 = drill 1.016: 1 -2.54,0; 2 0,0; 3 2.54,0
PAD.012X.012 = smd 0.305 x 0.305: P$1 0,0
IC57_RP2040-L = smd 0.708 x 0.179: 1 -3.351,2.6; 2 -3.351,2.2; 3 -3.351,1.8; 4 -3.351,1.4; 5 -3.351,1; 6 -3.351,0.6; 7 -3.351,0.2; 8 -3.351,-0.2; 9 -3.351,-0.6; 10 -3.351,-1; 11 -3.351,-1.4; 12 -3.351,-1.8; 13 -3.351,-2.2; 14 -3.351,-2.6; 29 3.351,-2.6; 30 3.351,-2.2; 31 3.351,-1.8; 32 3.351,-1.4; 33 3.351,-1; 34 3.351,-0.6; 35 3.351,-0.2; 36 3.351,0.2; 37 3.351,0.6; 38 3.351,1; 39 3.351,1.4; 40 3.351,1.8; 41 3.351,2.2; 42 3.351,2.6 | smd 0.179 x 0.708: 15 -2.6,-3.351; 16 -2.2,-3.351; 17 -1.8,-3.351; 18 -1.4,-3.351; 19 -1,-3.351; 20 -0.6,-3.351; 21 -0.2,-3.351; 22 0.2,-3.351; 23 0.6,-3.351; 24 1,-3.351; 25 1.4,-3.351; 26 1.8,-3.351; 27 2.2,-3.351; 28 2.6,-3.351; 43 2.6,3.351; 44 2.2,3.351; 45 1.8,3.351; 46 1.4,3.351; 47 1,3.351; 48 0.6,3.351; 49 0.2,3.351; 50 -0.2,3.351; 51 -0.6,3.351; 52 -1,3.351; 53 -1.4,3.351; 54 -1.8,3.351; 55 -2.2,3.351; 56 -2.6,3.351 | smd 3.2 x 3.2: 57 0,0
SOIC_128JVSIQ_WIN-L = smd 1.213 x 0.483: 1 -3.595,1.905; 2 -3.595,0.635; 3 -3.595,-0.635; 4 -3.595,-1.905; 5 3.595,-1.905; 6 3.595,-0.635; 7 3.595,0.635; 8 3.595,1.905
D8-L = smd 1.255 x 0.508: 1 -2.621,1.905; 2 -2.621,0.635; 3 -2.621,-0.635; 4 -2.621,-1.905; 5 2.621,-1.905; 6 2.621,-0.635; 7 2.621,0.635; 8 2.621,1.905
DBV5-L = smd 0.772 x 0.458: 1 -1.262,0.95; 2 -1.262,0; 3 -1.262,-0.95; 4 1.262,-0.95; 5 1.262,0.95
ADXL345_LGA14 = smd 1.145 x 0.55: 1 -1.097,2; 2 -1.097,1.2; 3 -1.097,0.4; 4 -1.097,-0.4; 5 -1.097,-1.2; 6 -1.097,-2; 8 1.097,-2; 9 1.097,-1.2; 10 1.097,-0.4; 11 1.097,0.4; 12 1.097,1.2; 13 1.097,2 | smd 0.55 x 1.145: 7 0,-2.098; 14 0,2.098
QFN28_5X5_3X8_EPAD_TRI = smd 0.757 x 0.255: 1 -2.423,1.5; 2 -2.423,1; 3 -2.423,0.5; 4 -2.423,0; 5 -2.423,-0.5; 6 -2.423,-1; 7 -2.423,-1.5; 15 2.423,-1.5; 16 2.423,-1; 17 2.423,-0.5; 18 2.423,0; 19 2.423,0.5; 20 2.423,1; 21 2.423,1.5 | smd 0.255 x 0.757: 8 -1.5,-2.423; 9 -1,-2.423; 10 -0.5,-2.423; 11 0,-2.423; 12 0.5,-2.423; 13 1,-2.423; 14 1.5,-2.423; 22 1.5,2.423; 23 1,2.423; 24 0.5,2.423; 25 0,2.423; 26 -0.5,2.423; 27 -1,2.423; 28 -1.5,2.423 | smd 3.7 x 3.7: 29 0,0
CONN12_KH-TYPE-C-16P = smd 0.52 x 1: 1 -3.1,1.1; 2 -2.35,1.1; 11 2.35,1.1; 12 3.1,1.1 | smd 0.27 x 1: 3 -1.75,1.1; 4 -1.25,1.1; 5 -0.75,1.1; 6 -0.25,1.1; 7 0.25,1.1; 8 0.75,1.1; 9 1.25,1.1; 10 1.75,1.1 | smd 1.2 x 2.2: 13 -4.32,0.725; 14 4.32,0.725 | smd 1.2 x 2.5: 15 -4.32,-3.1; 16 4.32,-3.1 | smd 1.2 x 1.9: 18 -1.4,-3.1; 19 1.4,-3.1 | drill 0.65 pad 0.65: 20 -4.32,1.225; 21 -4.32,0.225; 24 4.32,1.225; 25 4.32,0.225; 26 4.32,-2.45; 27 4.32,-3.75; 28 -4.32,-2.45; 29 -4.32,-3.75 | smd 1.2 x 2.5 bottom: 37 -4.32,-3.1; 41 4.32,-3.1 | smd 1.2 x 2.2 bottom: 39 -4.32,0.725; 43 4.32,0.725 | hole 0.6: -2.9,0; 3.125,0; 2.875,0
CRYSTAL_3225 = smd 1.4 x 1.2: P$1 -1.1,-0.85; P$2 1.1,-0.85; P$3 1.1,0.85; P$4 -1.1,0.85

### Placement (x,y rotation side)
120R  10.76,21.93 0 top
BOOT  19.43,30.01 180 top
C1  24.41,14.53 90 top
C2  29.81,14.64 90 top
C3  31.17,30.02 90 top
C4  30.21,30.02 90 top
C5  33.18,25.83 0 top
C6  34.25,21.93 0 top
C7  31.08,15.63 270 top
C8  27.21,30.02 90 top
C9  20.5,22.82 180 top
C10  23.22,27.88 90 top
C11  26.26,30.02 90 top
C12  32.04,15.63 270 top
C13  33.18,26.78 0 top
C14  17.56,9.42 270 top
C15  25.02,11.42 90 top
C16  18.52,9.42 270 top
C17  24.07,11.41 90 top
C18  9.69,10.79 270 top
C19  8.37,11.08 270 top
C20  14.56,9.54 90 top
C21  17.36,12.61 270 top
C22  19.45,12.61 90 top
C23  17.79,17.57 90 top
C24  27.78,38.12 180 top
C25  30.71,11.52 180 top
C26  8.8,27.9 180 top
C27  18.23,26 270 top
C28  41.35,26.88 0 top
C29  41.35,27.85 180 top
C30  42.4,17 0 top
C31  42.4,17.95 0 top
C32  36.14,24.86 270 bottom
C33  39.58,13 0 top
C34  38.14,19.17 180 top
C38  38.57,8.22 90 top
C39  45.6,15.09 90 top
C40  40.79,9.03 180 top
C41  10.27,29.95 90 top
C42  6.23,4.95 90 bottom
C43  13.78,4.77 90 bottom
C44  22.36,4.87 90 bottom
C45  31.27,3.23 90 bottom
C46  22.05,6.3 0 top
CAN  3.5,33.5 270 top
D1  37.5,29.74 0 top
D2  32.87,32.26 0 top
D3  24.6,8.97 270 top
D4  40.02,10.57 0 bottom
D5  25.99,9.08 270 bottom
D6  5.69,9.08 270 bottom
D7  12.9,8.5 270 bottom
D8  21.96,8.47 270 bottom
D9  20.5,25.5 0 top
E0  46.9,18.79 90 top
EX-  3.5,25.5 270 top
F1  40,31.5 0 top
FAN0  2.5,2.5 0 top
FAN1  10.5,2.5 0 top
FAN2  18.5,2.5 0 top
FAN3  26.5,2.5 0 top
FD1  2,38 0 top
FD2  48,38 0 top
FD3  40.5,1.5 0 top
FD4  2,38 0 bottom
FD5  48,38 0 bottom
FD6  40.5,1.5 0 bottom
GND  34.8,17.33 0 top
IO16  31.85,18.89 0 top
IO17  32.65,19.69 0 top
IO18  33.15,18.88 0 top
IO19  33.94,19.52 0 top
IO22  32.67,22.4 0 top
IO23  34.25,23.07 0 top
J2  2.5,12 90 top
J3  49.31,8.08 0 top
L1  11.56,16.37 0 top
L2  8.8,26 180 top
LOGO  [FWLOGO_SMALL]  26,34 0 bottom
M1  51.69,13.83 270 top
M2  3.4,6.79 270 bottom
M3  10.12,6.21 270 bottom
M4  18.72,6.19 270 bottom
P1  12.01,10.41 270 top
P2  21.35,8.91 270 top
PT1000  33.41,12.08 90 top
R1  32.93,28.77 180 top
R2  32.93,27.76 0 top
R3  27.47,17.09 180 top
R4  26.79,18.17 180 top
R5  10.97,7.45 270 top
R6  12,7.45 90 top
R7  16.87,15.6 270 top
R8  16.87,17.6 270 top
R9  16.88,19.83 270 top
R10  28.2,29.78 270 top
R11  29.22,29.78 270 top
R12  19.08,32.25 180 top
R13  19.07,33.26 180 top
R14  28.42,11.49 180 top
R15  26.05,8.85 90 top
R16  8.19,24.05 270 top
R17  22.39,17.82 0 bottom
R18  22.39,16.8 0 bottom
R19  20.43,16.82 180 bottom
R20  20.43,17.84 180 bottom
R21  35.66,26.4 90 top
R22  36.91,21.58 270 top
R23  36.7,26.39 270 top
R24  38.14,18.17 0 top
R25  38.14,17.14 0 top
R26  45,24.6 270 top
R27  45,20.6 90 top
R28  20.5,24.02 0 top
R30  44.14,11.59 0 bottom
R31  48.31,14.61 180 top
R32  17.46,32.74 90 top
R33  37.3,10.84 270 bottom
R34  36.12,11.73 90 bottom
R35  38.48,12.37 90 bottom
R36  40.5,13.29 180 bottom
R37  48.31,15.5 0 top
R38  16.06,29.22 0 top
R40  17.27,22.55 180 top
R41  17.27,21.57 180 top
R44  8.13,7.38 90 top
R45  8.24,9.56 90 bottom
R46  9.17,7.37 90 top
R47  9.31,8.95 90 bottom
R48  18.31,7.13 180 top
R49  18.37,9.96 0 bottom
RGB  8.63,32.83 90 top
RST  29,9.5 0 top
SERVO  27.43,6.2 180 top
SWCLK  33.17,16.26 0 top
SWDIO  34.04,15.37 0 top
TP1  17.37,14.65 0 top
TP3  22.66,11.19 0 top
TP7  31.07,31.76 0 top
TP8  31.08,32.76 0 top
U1  27.5,23 0 top
U2  24.73,34.48 0 top
U3  14,26 180 top
U4  18.92,30.01 90 bottom
U5  21.42,17.85 0 top
U6  46.67,13.5 0 bottom
U7  40.91,22.6 270 top
USB  34.8,35.37 180 top
VBUS  42.72,33.64 90 top
X1  27.14,14.71 0 top

### Tracks (layer width: path | path; a pad name or v marks a point on that pad's centre or on a via)
+1.1V
  Top 0.2: 29.28,25.48 29.3,25.5 U1.45 29.3,28.17 30.21,29.08 C4.1 | 29.28,25.48 29.45,25.31 29.45,21.25 29.24,21.04 28.93,21.04 28.1,20.21 U1.23 28.1,19 29.82,17.28 31.42,17.28 32.04,16.66 C12.1 | C11.1 26.26,28.09 27.3,27.05 U1.50 27.3,25.5 27.68,25.12 28.92,25.12 29.28,25.48
+3.3V  (via drill 0.35)
  Top 0.2: v27.7,20.5 U1.22 27.7,18.92 29.68,16.94 30.32,16.94 C7.1 | U1.10 23.31,22 v23.2,22.11 | v25.01,25.42 24.83,25.6 U1.1 24.15,26.41 C10.1 | v30.12,22 U1.33 32.21,22 32.42,21.79 32.92,21.79 33.07,21.93 C6.1 34.2,21.44 34.74,21.44 35.18,21 v35.5,21 | C15.1 25.65,11.5 v26.5,11.5 26.51,11.49 R14.2 | C8.1 27.21,28.84 v27.9,28.15 | v27.9,28.15 28.1,27.95 U1.48 28.1,25.81 27.9,25.61 v27.89,25.61 v27.88,25.6 27.88,25.61 27.7,25.79 U1.49 27.7,27.95 v27.9,28.15 | C3.1 31.17,29.17 | 31.17,29.17 29.7,27.7 U1.44 29.7,25.76 v29.89,25.57 29.91,25.59 U1.42 31.4,25.6 31.63,25.83 C5.1 33.13,25.33 35.03,25.33 R21.1 | R1.2 31.56,28.77 31.17,29.17 | U7.15 39.41,19.89 C34.1 38.69,19.85 v38.56,19.98 | C24.1 U2.8 | v18.74,34.15 18.64,34.05 R13.2
  Top 0.305: v21.65,9.55 v21.65,9.56 21.96,9.86 P2.5 23.65,10.86 C17.1 C15.1 26.05,9.84 R15.2 | v14,24 14,26.5 12.6,27.91 U3.5 C26.1 | R41.1 18.43,21.57 v19,21 19.83,21 20.33,20.5 | 20.33,20.5 U5.1 19.51,19.85 18.42,18.76 18.42,16.84 19.41,15.85 U5.6 20.35,15.83 v20.35,15.14 22.5,12.99 22.66,12.83 TP3.P$1 P2.5 | 20.33,20.5 20.33,22.1 C9.1 22.32,22.82 23.03,22.11 v23.2,22.11 | U2.8 27.38,36.38 27,36 v27,34.5
  Top 0.406: P2.5
  Bottom 0.2: D4.2 39.08,9.64 38.31,10.41 R33.2 36.95,10.76 35.78,10.76 35.74,10.81 PT1000.1 28.89,10.81 | R17.2 R18.2 21.33,16.17 | R20.2 R19.2 21.33,16.36 21.33,16.17 | 21.33,16.17 20.34,15.19 v20.35,15.14 | 28.89,10.81 28.83,10.81 28.04,10.02 28.04,8.9 27.27,8.13 D5.2 | v38.56,19.98 37.54,21 v35.5,21 | v27,34.5 26.65,34.15 v18.74,34.15 | 28.89,10.81 28.2,11.5 v26.5,11.5
  Bottom 0.305: D8.2 22.78,7.52 21.96,8.34 21.96,9.24 v21.65,9.55 19.84,9.55 17.85,7.55 D7.2 13.21,7.55 12.04,6.38 10.4,6.38 10.24,6.54 10.24,6.58 8.79,8.03 6.89,8.03 D6.2 | v14,24 16,24 v19,21 | v23.2,22.11 25,22.11 | 25,22.11 25.15,22.11 26.76,20.5 v27.7,20.5 28.62,20.5 v30.12,22 | 25,22.11 25.01,22.12 v25.01,25.42 25.19,25.6 v27.88,25.6 27.91,25.57 v29.89,25.57 | v27,34.5 27.9,33.6 v27.9,28.15
+5V  (via drill 0.35)
  Top 0.406: P2.1 20.05,11.14 C22.1 19.24,11.73 17.49,13.48 C21.1 TP1.P$1 16.87,15.15 R7.2 15.97,15.17 L1.2 14.76,25.78 15.62,26.64 | C14.1 C16.1 18.63,9.86 P2.1 | v41.45,14.35 40.51,14.35 39.97,13.81 39.97,12.52 38.97,11.52 36.32,11.52 32.32,7.52 28.75,7.52 SERVO.2 26.19,4.96 24.17,4.96 C46.2 21.16,7.96 21.07,7.96 | D1.1 v34.66,29.74 | v19,27.5 19,27.31 C27.1 18.15,26.64 U3.3 15.62,26.64 | RGB.1 9.52,29.4 C41.1 10.81,28.86 13.39,28.86 15.62,26.64 | P2.3 21.07,7.96 | P2.1 20.75,9.86 21.07,9.54 21.07,7.96 | C39.1 46.37,14.54 v46.47,14.44
  Bottom 0.406: v41.45,14.35 v41.46,14.34 41.57,14.45 U6.5 v46.47,14.44 | v34.66,29.74 32.42,27.5 v19,27.5 20.57,27.5 20.57,30.16 19.87,30.86 U4.5
+24V  (via drill 0.35)
  Top 0.2: C31.2 43.82,17.95 v43.86,17.91 | C30.2 42.97,17.02 43.82,17.02 v43.86,16.98 | C29.1 42.72,27.85 v42.86,27.71 | R5.2 10.97,4.53 11.75,3.75 12,4 12.66,4 13,3.66 FAN1.2
  Top 0.254: U7.28 44.3,24.1 44.3,24.43 v44.05,24.68 | U7.22 44.3,21.1 44.3,20.8 v44,20.5
  Bottom 0.2: v43.86,17.91 43.97,18.02 44.71,18.02 v44.82,17.91 | v43.86,16.98 44.13,16.71 44.54,16.71 v44.82,16.99 | v42.86,27.71 44,26.57 44,25.5
  Bottom 0.305: FAN3.2 31.23,2.5 C45.1 | FAN2.2 21,2.72 22.36,4.08 C44.1 | C43.1 13,3.22 FAN1.2 | C42.1 6.23,3.73 FAN0.2
  other vias: 44.33,17.45 43.34,25.38 44.05,25.38 43.99,19.77 43.33,20.21
  pour Top (isolate 0.254): 7.57,10.9 7.61,10.92 11.37,10.92 11.37,12.95 9.95,14.37 0.13,14.37 0.13,-0.37 41.93,-0.37 45.22,4.56 45.23,4.57 45.23,4.58 45.24,4.59 45.25,4.6 45.26,4.61 45.27,4.61 45.28,4.62 45.3,4.62 45.31,4.63 45.32,4.63 45.33,4.63 45.35,4.63 45.36,4.63 45.36,4.63 46.49,4.63 46.49,8.36 34.04,8.36 30.07,4.39 30.03,4.37 8.97,4.37 8.93,4.39 7.55,5.77 7.53,5.81 7.53,10.04 7.53,10.04 7.51,10.08 7.51,10.82 7.53,10.86
  pour Top (isolate 0.305): 42.18,15.23 42.18,8.51 44.98,8.51 44.98,18.27 43.36,18.27 43.36,16.43 43.34,16.39
  pour Top (isolate 0.305): 43.1,23.63 44.37,23.63 44.37,25.64 43.24,25.64 43.1,25.5
  pour Top (isolate 0.305): 43.21,19.55 44.36,19.55 44.36,21.45 43.09,21.45 43.09,19.67
  pour Bottom: 43.33,18.47 43.35,18.43 43.35,16.55 45.06,16.55 45.06,18.39 45.04,18.41 45.02,18.45 45.02,18.59 44.44,19.17 44.42,19.21 44.42,25.68 44.19,25.91 43.97,25.91 43.95,25.9 43.54,25.9 43.1,25.46 43.1,18.7
A1
  Top 0.2: 43.85,22.1 U7.24
  Top 0.305: E0.2 46.09,22.1 43.85,22.1
  pour Top (no thermals): 45.9,21.89 46.87,21.02 47.31,21.44 46.29,22.37 44,22.37 43.79,22.16 43.79,22.12 44,21.91 45.84,21.91 45.85,21.91 45.86,21.91 45.86,21.91 45.87,21.9 45.88,21.9 45.88,21.9 45.89,21.89
A2
  Top 0.2: 42.41,19.84 U7.21
  Top 0.305: E0.1 43.46,18.79 42.41,19.84
  pour Top (no thermals): 42.36,19.14 42.89,18.61 46.98,18.62 46.98,19.21 43.07,19.2 43.07,19.2 43.05,19.2 43.04,19.2 43.03,19.2 43.03,19.2 43.02,19.21 43.01,19.22 43.01,19.22 43.01,19.22 43,19.23 42.99,19.24 42.99,19.24 42.51,19.71 42.36,19.71
ADC_AVDD
  Top 0.2: R2.1 32.5,26.91 C13.1 31.57,26.78 31.15,26.35 U1.43
ADC_R
  Top 0.2: R2.2 R1.1
B1
  Top 0.2: U7.26 43.86,23.1
  Top 0.305: E0.3 46.21,23.1 43.86,23.1
  pour Top (no thermals): 44,22.82 46.29,22.82 47.31,23.75 46.87,24.17 45.9,23.3 45.89,23.3 45.88,23.29 45.88,23.29 45.87,23.29 45.86,23.28 45.86,23.28 45.85,23.28 45.84,23.28 44,23.28 43.79,23.07 43.79,23.03
B2
  Top 0.2: 42.41,25.55 U7.1
  Top 0.305: E0.4 43.16,26.29 42.41,25.55
  pour Top (no thermals): 42.36,25.48 42.51,25.48 42.99,25.95 42.99,25.95 43,25.96 43.01,25.97 43.01,25.97 43.01,25.97 43.02,25.98 43.03,25.99 43.03,25.99 43.04,25.99 43.05,25.99 43.07,25.99 43.07,25.99 46.98,25.98 46.98,26.57 42.89,26.58 42.36,26.05
BCBOOT
  Top 0.2: P1.6 14.49,9.06 C20.1
BRA
  Top 0.2: U7.23 43.36,21.57 44.46,21.57 R27.2
BRB
  Top 0.2: U7.27 43.36,23.63 44.6,23.63 45,24.03 R26.2
CAN1_N
  Top 0.2: U3.6 10.38,26.64 10.15,26.41 L2.2
CAN1_P
  Top 0.2: L2.1 10.15,25.59 10.38,25.36 U3.7
CAN_N
  Top 0.2: 120R.2 10.97,22.08 9.03,24.31 9.03,25.72 8.34,26.41 L2.3 7.88,26.94 4.82,30 4.82,32.24 3.56,33.5 CAN.1
CAN_P
  Top 0.2: R16.1 8.22,24.52 7.88,24.86 L2.4 7.74,25.59 7.25,26.08 7.25,27.06 3.6,30.71 3.5,30.81 CAN.2
CAN_RX
  Top 0.2: U3.4 17.02,27.91 17.92,28.81 20.04,28.81 23.65,25.2 U1.2
CAN_TX
  Top 0.2: U1.3 23.55,24.8 21.84,26.51 19.37,26.51 18.73,25.87 18.73,24.96 17.86,24.09 U3.1
CNT
  Top 0.2: R16.2 8.19,23.23 120R.1
DIR
  Top 0.2: U7.19 41.41,19.04 39.51,17.14 R25.2
E0_DIAG
  Top 0.2: U7.11 37.4,22.6 35.35,24.66 32.72,24.66 32.46,24.4 U1.39
E0_DIR
  Top 0.2: U1.32 32.14,21.6 32.31,21.44 33.35,21.44 34.3,20.48 34.36,20.48 R25.1
E0_EN
  Top 0.2: U1.40 32.4,24.8 32.58,24.98 35.73,24.98 R23.2
E0_STEP
  Top 0.2: U1.36 32,23.2 32.14,23.34 32.79,23.34 33.12,23.67 34.5,23.67 36.07,22.1 36.07,20.97 36.68,20.36 36.68,19.11 37.61,18.17 R24.1
E0_UART
  Top 0.2: U7.14 36.96,21.1 R22.2 36.4,21.65 36.4,22.23 34.63,24 32.99,24 32.65,23.66 31.8,23.66 31.73,23.6 U1.37
ENDSTOP_X  (via drill 0.35)
  Top 0.2: U1.9 23.6,22.4 v23.04,22.96 | v18.5,22.96 18.35,22.96 17.89,22.5 17.75,22.5
  Top 0.305: 17.75,22.5 R40.1
  Bottom 0.2: v23.04,22.96 v18.5,22.96
EX  (via drill 0.35)
  Top 0.2: v16,22.5 16.05,22.55 R40.2 R41.2
  Bottom 0.2: v16,22.5 13.08,22.5 12.51,23.07 7.5,23.07 7.28,23.07 3.57,23.07 EX-.2
FAN0  (via drill 0.35)
  Top 0.152: R44.2 9.4,9.08 9.83,9.08 v10.21,9.46
  Top 0.2: v21.57,22.06 21.6,22.09 22.44,22.09 22.93,21.6 U1.11
  Bottom 0.2: v21.57,22.06 21.42,21.91 21.27,21.91 17.67,18.31 17.67,16.6 10.54,9.46 v10.21,9.46 10.11,9.46 9.58,9.99 R45.2
FAN0D
  Bottom 0.305: M2.3 2.3,2.7 FAN0.1
FAN0G  (via drill 0.35)
  Top 0.2: R44.1 7.68,6.94 v7.45,7.17
  Bottom 0.2: D6.3 4.5,8.99 M2.1 5.01,7.23 7.39,7.23 v7.45,7.17
FAN1  (via drill 0.35)
  Top 0.152: R46.2 9.87,8.5 v10,8.5
  Top 0.2: U1.12 22.85,21.2 22.6,21.45 22.4,21.45 v22.25,21.6
  Bottom 0.2: v22.25,21.6 22.23,21.58 21.4,21.58 18,18.18 18,16.46 10.04,8.5 v10,8.5 10,8.73 9.43,9.31 9.39,9.31 R47.2
FAN1D
  Bottom 0.305: FAN1.1 9.02,3.98 M3.3
FAN1G  (via drill 0.35)
  Top 0.2: R46.1 9.53,7.29 v9.98,7.74
  Bottom 0.2: v9.98,7.74 10.47,7.74 11.05,7.16 M3.1 11.8,7.16 D7.3
FAN2  (via drill 0.35)
  Top 0.2: U1.13 22.79,20.8 22.46,21.12 21.62,21.12 v21.59,21.09 | v16.38,8.55 16.56,8.55 17.88,7.23 R48.2
  Bottom 0.2: v21.59,21.09 18.33,17.83 18.33,10.35 R49.2 17.79,9.96 v16.38,8.55
FAN2D
  Bottom 0.305: M4.3 17.62,3.38 FAN2.1 20,1 25,1 FAN3.1
FAN2G  (via drill 0.35)
  Top 0.2: v20.34,6.22 19.42,7.14 19.42,7.13 R48.1
  Bottom 0.2: D8.3 20.32,7.93 20.32,7.14 M4.1 20.34,7.14 v20.34,6.22
GND  (via drill 0.35)  (342 unrouted)
  Top 0.2: M1.P$3 M1.P$2 M1.P$1 | 3.6,21.75 2.5,20.65 J2.2 | R38.1 15.62,28.42 15.55,28.35 v14.94,28.35 | v40.04,9.97 40.26,9.75 40.26,9.04 C40.2 38.63,9.03 C38.2 | U7.13 39.4,21.6 39.5,21.5 39.81,21.5 U7.29 v40.42,22.11 v40.41,22.11 | C6.2 35.42,21.93 v35.58,21.77 | C34.2 37.5,19.27 v37.5,20 | C19.2 8.37,10.4 v9.04,11.07 9.04,10.98 9.46,10.55 9.55,10.55 9.69,10.42 C18.2 | USB.1 38.99,34.27 USB.20 | USB.43 30.86,34.27 USB.12 | U7.3 v41.42,24.1
  Top 0.305: U5.5 19.36,16.65 v18.95,17.06
  Top 0.406: C27.2 18.15,25.36 U3.2 | v37,9 37.09,9.09 C38.2 38.5,9.16 38.5,10.5 | P2.2 18.56,8.91 C16.2 C14.2 16.91,8.88 14.39,11.4 15,11.4 v15,11.5
  Bottom 0.2: 45.92,6.42 45.48,5.98 43.84,5.98 43.84,2.87 | v40.04,9.97 40.04,9.47 D4.1 | R47.1 8.24,8.52 R45.1
  Bottom 0.203: 8.24,8.88 R45.1 8.23,9.13 7.74,9.62 7.74,10.62 8.19,11.07 v9.04,11.07
  Bottom 0.305: C44.2 21.73,5.65 v21.24,5.16 | C43.2 v12.79,5.54 | C42.2 4.61,5.73 M2.2
  other vias: 26.5,24 27.5,24 28.5,24 28.5,23 27.5,23 26.5,23 26.5,22 27.5,22 28.5,22 35.5,16 36,17 36.82,16.18 36.62,14.79 37.69,15.39 37.22,14.2 38.52,14.5 27.93,17.81 28.61,17.29 29.2,16.66 30.03,16.18 25,17.24 25.87,18.87 25.57,17.78 25.82,16.81 24.68,16.14 23.8,16.13 24.14,13.01 23.5,13.5 23.4,14.47 25,13 26,12.5 27,12.5 28,12.5 29.81,13.01 31.09,13.81 22.43,32.59 23.22,29.53 23.41,26.39 22.21,28.43 21.17,28.58 23.81,31.27 24.86,32.33 36.19,32.38 37.49,32.4 32.05,31.06 31.96,29.51 33.47,29.56 34.96,31.26 34.91,28.72 34.83,25.92 34.84,26.99 34.17,27.63 39.41,24.1 40.42,24.1 42.42,24.1 42.42,21.11 39.41,21.11 39.41,23.1 39.41,22.11 40.42,21.11 41.42,21.11 42.42,22.11 42.42,23.1 40.41,23.1 41.42,23.1 41.42,22.11 38.5,25 37.16,25.01 37.5,26 38.89,26.1 18.5,24 19,23.5 19.74,21.61 18.66,22.2 19.1,21.76 17.63,23.44 15.5,23.47 15.46,24.74 15.45,25.55 15.5,21.5 16,20.5 15.5,19.5 16,18.79 14,18 14,19.5 14,21 14,22 14,23 13,24 13,25 13,26 12.5,27 10,24.5 9,27 14.88,14.73 13.83,14.72 13.98,13.78 12.87,13.83 12.92,12.83 14,11.5 15,12.5 16,13.5 16,12.5 19.46,10.71 22,11.5 21.38,10.19 20.62,12.4 20.98,11.29 22.5,14 39.83,16.71 41,17 40.91,17.84 41.85,18.8 40.78,19.25 40.16,18.69 39.51,18.13 41.5,15.5 40.5,15 39.34,15.67 41.38,25.79 31.54,32.27 30.61,32.25 36.5,10 36,9 35.62,9.81 34.89,9.05 35.15,11.53 32.01,8.18 28.23,7.87 29,8.23 31.67,10.24 32.37,11.75 41.02,11.11 38.17,10.92 29,12.5 32.96,15.18 46.74,12.74 47.69,10.82 49.5,13.5 45.67,18 47.9,17.35 11.5,14.5 12.5,15.5 13.5,16.5 15,5 16,5 17,5 28.5,5 33,9.5 26,38 22.5,35 25,35 24,33.5 22.5,30.5 28.51,31.71 27.15,31.63 26.99,28.23 33.5,31 22.08,25.17 5.5,30.5 6.5,29.5 7.37,28.66 9.44,28.69 13.16,28.19 14.65,26.66 15.49,27.78 4,29 5,28 6,27 7,25.5 7.5,24.14 1.5,25.5 6.15,23.69 4.76,22.42 7.5,22.5 8.92,23.65 17.79,27.58 22.07,23.55 30,24.5 30,20.5 30.03,22.77 23.24,12.05 29.74,10.24 35.2,14.33 34.2,18.43 36,20 34.5,20.96 46,20 47.9,22.5 45.97,25.03 45.72,27.5 44.5,27.5 42.69,27.08 47.9,19.93 47.9,25.07 49,18.64 49,21.21 49,23.79 49,26.36 47.9,27.65 37.68,21.92 37.64,23.24 36.5,22.82 36.04,23.28 39.5,27.5 38.5,27.5 37.5,27.5 31.84,28.24 31,28.2 30.96,26.84 47.5,7 45,2 51,2 18.93,31.26 16.5,31 16.66,33.06 11,34.5 10.5,35.5 16,36 14.89,35 13,36 26,33.5 19,35 20,36.5 24.99,21.32 24.81,18.53 24.03,17.91 18.88,15.06 1,15 3,15 5,15 7,15 7,18 12.5,16.5 11.5,15.5 16.5,9.5 16.5,10.5 15.35,8.3 16,7 47.68,9.48 46.23,9.49 45.56,13.58 46.64,15.65 45.62,16.72 53.41,14.93 52.12,16.32 51.35,16.33 50.62,16.33 53.4,13.59 53.4,12.2 49.5,16.5 53.33,8.96 50.5,6 52,7.5 51.5,4 17.8,15.42 18,19.5 49,35 46,39 3.5,39 1,36 39.65,3.22 32.7,1
  pour Top (rank 2): 0.1,0.1 54.4,0.1 54.4,39.9 0.1,39.9
  pour Bottom (rank 2): 0.1,0.1 54.9,0.1 54.9,39.9 0.1,39.9
GPIOLED
  Top 0.2: R28.1 20.07,24.05 21.25,25.23 D9.A
HE0  (via drill 0.35)
  Top 0.2: U1.31 32.03,21.2 32.14,21.09 33.23,21.09 37.18,17.14 37.18,16.64 37.63,16.19 v41.97,16.19 | R37.2 49.63,15.49 v49.65,15.48
  Bottom 0.2: U6.2 48.18,13.5 49.65,14.96 v49.65,15.48 49.63,15.5 48,15.5 47.31,16.19 v41.97,16.19
HE0_PWR
  Top 0.305: 50.74,13.48 M1.P$5 50.74,10 | M1.P$9 52.04,13.48 M1.P$7 52.04,10.65 | M1.P$9 52.13,13.83 52.69,13.27 M1.P$8 52.69,10.06 | M1.P$9 51.39,13.53 M1.P$6 51.39,11.3
  Top 0.406: 50.89,9.85 50.01,9.85 49.31,9.15 J3.1 50.71,8.08 52.69,10.06 | 50.74,10 50.89,9.85 | 51.39,11.3 52.04,10.65 51.24,9.85 50.89,9.85 | M1.P$9 51.34,13.48 50.74,13.48
  pour Top: 50.55,11.29 48.38,9.12 48.38,7.16 50.3,7.16 52.82,9.68 52.82,14.43 50.57,14.43 50.57,11.33
HE0A  (via drill 0.35)
  Top 0.2: v46.97,14.96 47.53,14.96 R31.2
  Bottom 0.2: R30.2 44.06,11.95 44.06,11.96 44.19,12.09 44.95,12.09 U6.4 46.97,14.11 v46.97,14.96
HE0B
  Top 0.2: R31.1 50.04,14.62 50.74,15.31 M1.P$4
I2C_SCL
  Top 0.2: U1.35 32.2,22.8 32.41,23.01 34.19,23.01 IO23.P$1
I2C_SDA
  Top 0.2: U1.34 IO22.P$1
LDOLED
  Top 0.2: R15.1 25.85,8.22 D3.A
LED
  Top 0.2: R28.2 21.48,24.57 23.14,24.57 23.31,24.4 U1.4
NEOPIXEL  (via drill 0.35)
  Top 0.2: U1.5 22.87,24 v22.79,24.08 | R38.2 16.49,30.07 v16.69,30.27
  Bottom 0.2: v22.79,24.08 19.42,24.08 18.46,25.04 18.46,28.09 18.92,28.55 U4.2 18.92,28.91 17.56,30.27 v16.69,30.27
OSC_IN
  Top 0.2: U1.20 26.9,19.48 arc-45 R4.2 26.36,17.32 arc45 26.67,16.55 26.87,16.35 arc-45 27.16,15.65 27.16,15.4 arc-45 26.78,14.48 26.23,13.93 arc-45 X1.P$1 arc45 25.46,13.98 C1.1
OSC_OUT
  Top 0.2: U1.21 27.3,18.36 arc45 R4.1 27.04,17.99 27.04,17.17 27.04,17.16 R3.2
QSPI_SCK
  Top 0.2: U1.52 26.5,26.92 25.43,27.99 25.43,32.08 27.2,33.84 U2.6
QSPI_SD0  (via drill 0.35)
  Top 0.2: U1.53 26.1,26.86 25.11,27.85 25.11,31 24.95,31.15 v24.95,31.44 | U2.5 27.11,32.57 v27.05,32.51
  Bottom 0.2: v27.05,32.51 25.98,31.44 v24.95,31.44
QSPI_SD1
  Top 0.2: U1.55 25.3,26.73 24.45,27.58 24.45,29.79 22.38,31.85 20.68,31.85 20.3,32.24 20.3,34.63 20.79,35.11 U2.2
QSPI_SD2
  Top 0.2: U1.54 25.7,26.8 24.78,27.72 24.78,30.86 24.45,31.19 24.45,31.82 22.43,33.84 U2.3
QSPI_SD3
  Top 0.2: U1.51 26.9,26.98 25.76,28.12 25.76,31.9 27.04,33.18 28.83,33.18 29.16,33.51 29.16,34.58 28.62,35.11 U2.7
QSPI_SS
  Top 0.2: U1.56 24.9,26.67 24.12,27.45 24.12,29.65 22.26,31.52 20.24,31.52 R12.1 19.51,33.25 R13.1 19.5,35.08 20.8,36.38 U2.1
RESET
  Top 0.2: U1.26 29.3,19.21 30.24,18.26 32.74,18.26 34.8,16.2 34.8,14.93 34.44,14.57 32.93,14.57 30.16,11.8 C25.2 | RST.2 30.75,10.93 C25.2 | C25.2 30.13,11.49 R14.1
RGBDATA
  Top 0.2: RGB.2 11.3,35.5 15.14,35.5 R32.2
RGBDATA1  (via drill 0.35)
  Top 0.2: R32.1 17.46,32.26 v16.92,31.72
  Bottom 0.2: U4.4 17.35,31.27 16.92,31.7 v16.92,31.72
SERVO  (via drill 0.35)
  Top 0.2: v22.27,20.65 22.51,20.4 U1.14
  Bottom 0.2: v22.27,20.65 21.87,20.65 19.43,18.21 19.43,14.85 24.89,9.39 D5.3 | SERVO.3 D5.3 | D5.3
SPI0_CS
  Top 0.2: U1.28 30.14,19.69 IO17.P$1
SPI0_MISO
  Top 0.2: IO16.P$1 31.67,19.07 29.92,19.07 29.7,19.28 U1.27
SPI0_MOSI
  Top 0.2: U1.30 31.91,20.8 31.97,20.74 32.92,20.74 33.86,19.8 33.86,19.6 IO19.P$1
SPI0_SCK
  Top 0.2: U1.29 32.8,20.4 33.26,19.94 33.26,18.99 IO18.P$1
SPI1_CS  (via drill 0.35)
  Top 0.2: U5.7 21.42,15.46 21.71,15.17 v22.53,15.17 23.11,15.17 23.32,15.38 23.32,16.35 25.3,18.33 U1.16
  Bottom 0.2: R19.1 19.79,16.6 19.79,14.95 20.3,14.44 21.8,14.44 v22.53,15.17
SPI1_MISO  (via drill 0.35)
  Top 0.2: U5.12 23.11,19.05 23.52,18.64 v23.52,18.57 24.15,18.57 24.9,19.32 U1.15
  Bottom 0.2: v23.52,18.57 v23.53,18.56 23.53,17.44 22.89,16.8 R18.1
SPI1_MOSI  (via drill 0.35)
  Top 0.2: v23.51,19.41 23.07,19.85 U5.13 | U1.18 26.1,20.4 v26,20.5
  Bottom 0.2: v26,20.5 24.91,19.41 v23.51,19.41 22.82,18.72 R17.1
SPI1_SCK  (via drill 0.35)
  Top 0.2: U1.17 25.7,20.11 v25.2,20.61 | v21.44,18.83 21.44,19.93 U5.14
  Bottom 0.2: v25.2,20.61 24.7,20.11 23.31,20.11 22.03,18.83 v21.44,18.83 20.52,18.83 19.92,18.23 19.92,17.92 R20.1
STEP
  Top 0.2: U7.16 39.91,19.2 R24.2
SWB
  Top 0.2: R12.2 17.68,31.28 BOOT.2
SWCLK
  Top 0.2: U1.24 28.5,19.08 29.97,17.61 32.39,17.61 33.17,16.83 SWCLK.P$1
SWDIO
  Top 0.2: U1.25 28.9,19.14 30.11,17.94 32.56,17.94 34.04,16.46 SWDIO.P$1
TH0  (via drill 0.35)
  Top 0.2: U1.38 31.18,24 31.21,24.02 32.55,24.02 32.85,24.33 35.02,24.33 35.24,24.11 v35.24,24.09 | v41.56,11.82 41.56,9.25 C40.1
  Bottom 0.2: v35.24,24.09 35.24,22.29 34.99,22.03 34.99,17.23 38.28,13.93 40.42,13.93 40.94,13.41 R36.2 40.94,12.44 v41.56,11.82
TH0A
  Bottom 0.2: R34.1 36.15,11.27 R33.1 37.96,11.94 R35.1 38.48,11.48 39.51,10.45 45.68,10.45 J3.4
TH0B
  Bottom 0.2: D4.3 40.07,11.72 R36.1 38.97,13.29 R35.2
TH0C
  Bottom 0.2: R34.2 34.59,12.16 PT1000.2
TMC5V  (via drill 0.35)
  Top 0.2: U7.8 v37.44,24.1
  Bottom 0.2: v37.44,24.1 37.42,24.08 C32.2
TMCCPI
  Top 0.2: U7.5 40.41,26.11 40.8,26.5 C28.1
TMCCPO
  Top 0.2: C28.2 41.8,26.88 41.22,26.3 41.16,26.3 40.88,26.02 40.88,25.62 40.91,25.59 U7.4
TMCENN  (via drill 0.35)
  Top 0.2: U7.2 41.91,25.78 41.92,25.79 v41.92,26.11 | v37.66,26.78 36.74,26.78 R23.1 35.67,26.82 R21.2
  Bottom 0.2: v37.66,26.78 37.68,26.8 41.15,26.8 41.84,26.11 v41.92,26.11
TMCVCP
  Top 0.2: C29.2 40.67,27.85 39.91,27.09 U7.6
USB1_N
  Top 0.2: R11.1 29.22,31.11 29.87,31.76 TP7.P$1 D2.3 D2.4 34.76,31.76 35.55,32.55 USB.5 35.55,34.82 35.35,35.02 34.76,35.02 34.55,34.81 USB.7
USB1_P
  Top 0.2: R10.1 28.2,30.55 30.41,32.76 TP8.P$1 D2.1 D2.6 34.01,32.76 34.55,33.3 | USB.6 35.05,33.8 34.55,33.3 | USB.8 34.05,33.81 34.55,33.3
USB_N
  Top 0.2: R11.2 28.9,29.02 U1.46
USB_P
  Top 0.2: R10.2 28.5,29.05 U1.47
VBUS
  Top 0.305: USB.11 32.45,34.95 33,35.5 36.6,35.5 37.15,34.95 USB.2
  Top 0.406: VBUS.2 40.4,32.59 38.19,32.59 37.15,33.63 USB.2
VBUS1  (via drill 0.35)
  Top 0.305: D2.5 34.24,32.26 v35.07,33.09
  Top 0.406: VBUS.1 41.85,31.5 F1.2
  Bottom 0.305: 42,33.09 VBUS.1
  Bottom 0.406: v35.07,33.09 42,33.09
VBUS2
  Top 0.305: 39.1,31.42 F1.1
  Top 0.406: D1.2 39.1,31.42
VRC
  Top 0.2: 17.64,17.17 C23.1 | R8.2
  Top 0.305: R8.2 17.64,17.17 | R7.1 R8.2
VREGEN
  Top 0.2: R5.1 R6.2 P1.5
VREGFB  (via drill 0.35)
  Top 0.2: 17.71,18.03 C23.2 | R8.1 16.88,18.04 | v16.23,18.03 v16.22,18.04 | 11.08,9.08 P1.4
  Top 0.305: 17.71,18.03 R8.1 v16.23,18.03 | 16.88,18.04 R9.2 | v11.08,10.68 11.08,9.08
  Bottom 0.305: v16.22,18.04 11.08,12.9 v11.08,10.68
VREGO
  Top 0.2: P1.2 12.01,10.99 12.91,10.09 C20.2
  Top 0.305: P1.2 12.01,12.81 8.45,16.37 L1.1
XR
  Top 0.2: C2.2 28.89,15.18 28.79,15.27 28.52,15.27 arc-45 X1.P$3 28.69,16.01 28.69,16.3 R3.1

### Text on the board
tNames: Fracktal Works Toolboard V1.1 / Adithyaa Designs '23 | L / H | SCL | SDA | GND | - / / EX- | CS MOSI | 24v+ GND | MISO SCK | B2 / B1 / A1 / A2 | GND | SWCLK | SWDIO | + - | + - | + - | + -
bNames: L / H | - / / EX- | 24v+ GND | B2 / B1 / A1 / A2 | - + | - + | - + | - +